# EAGLE design veils_v110 (EAGLE 5.09)

## Sheet 1 of 5
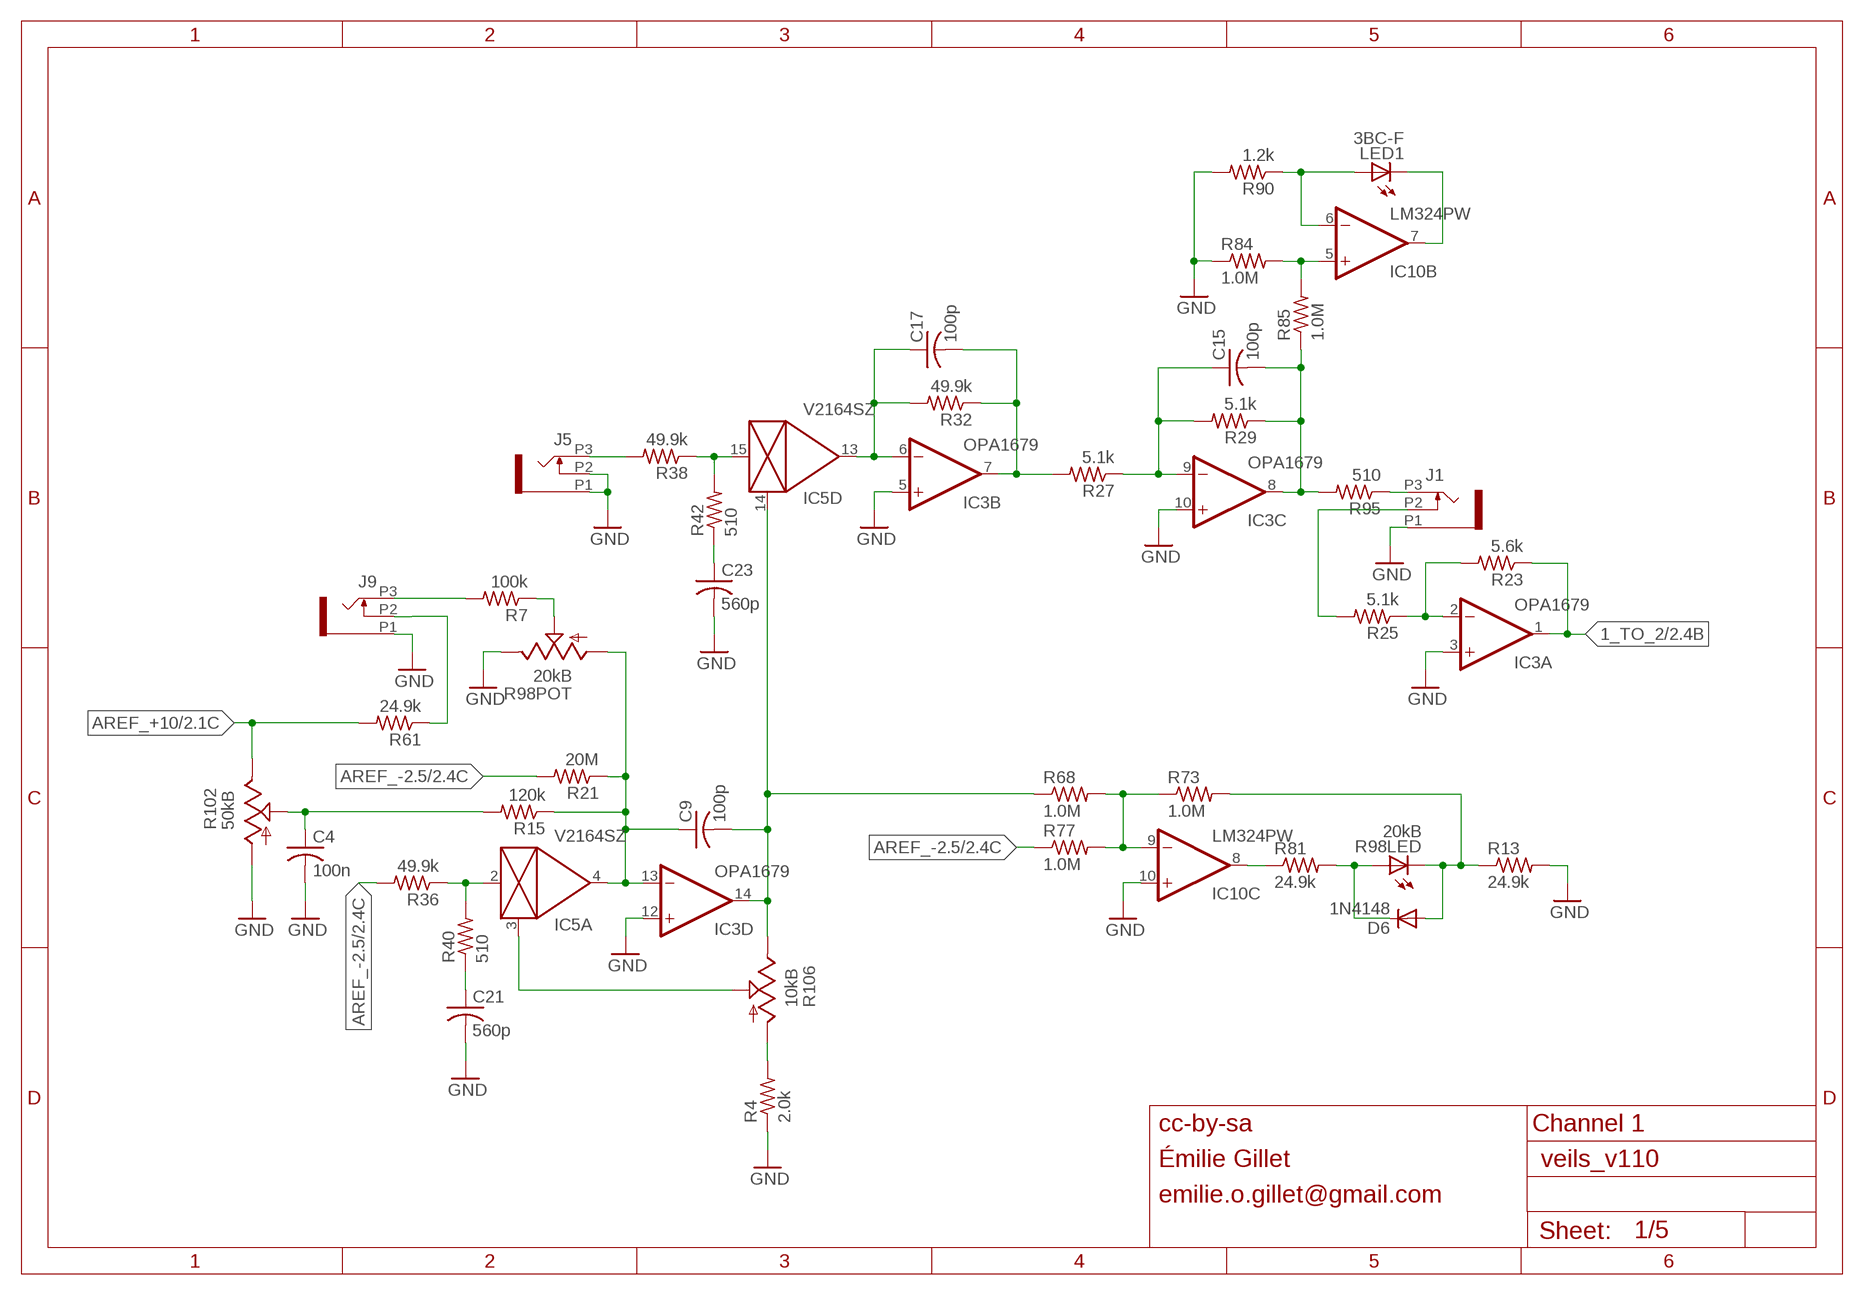
[diagram p0: schematic, sheet 1]

### Parts
C4  100n  C-USC0402  [C0402]
C9  100p  C-USC0402  [C0402]
C15  100p  C-USC0402  [C0402]
C17  100p  C-USC0402  [C0402]
C21  560p  C-USC0402  [C0402]
C23  560p  C-USC0402  [C0402]
D6  1N4148  DIODE-SOD523  [SOD523]
IC3  OPA1679  OPA1679PW  [TSSOP14_065]
IC5  V2164SZ  SSM2164S  [SOIC16N]
IC10  LM324PW  TL074PW  [TSSOP14_065]
J1  PJ301_THONKICONNTME  [WQP_PJ_301M_TME]
J5  PJ301_THONKICONNTME  [WQP_PJ_301M_TME]
J9  PJ301_THONKICONNTME  [WQP_PJ_301M_TME]
LED1  3BC-F  LED3MM  [LED3MM]
R4  2.0k  R-US_R0402  [R0402]
R7  100k  R-US_R0402  [R0402]
R13  24.9k  R-US_R0402  [R0402]
R15  120k  R-US_R0402  [R0402]
R21  20M  R-US_R0402  [R0402]
R23  5.6k  R-US_R0402  [R0402]
R25  5.1k  R-US_R0402  [R0402]
R27  5.1k  R-US_R0402  [R0402]
R29  5.1k  R-US_R0402  [R0402]
R32  49.9k  R-US_R0402  [R0402]
R36  49.9k  R-US_R0402  [R0402]
R38  49.9k  R-US_R0402  [R0402]
R40  510  R-US_R0402  [R0402]
R42  510  R-US_R0402  [R0402]
R61  24.9k  R-US_R0402  [R0402]
R68  1.0M  R-US_R0402  [R0402]
R73  1.0M  R-US_R0402  [R0402]
R77  1.0M  R-US_R0402  [R0402]
R81  24.9k  R-US_R0402  [R0402]
R84  1.0M  R-US_R0402  [R0402]
R85  1.0M  R-US_R0402  [R0402]
R90  1.2k  R-US_R0402  [R0402]
R95  510  R-US_R0603  [R0603]
R98  20kB  BOURNS_SLIDER  [BOURNS_SLIDER]
R102  50kB  POT_USVERTICAL_NARROW  [ALPS_POT_NARROW]
R106  10kB  POT_USVERTICAL_NARROW  [ALPS_POT_NARROW]

### Nets
1_TO_2: IC3.1(A:OUT) R23.1 ; also sheet 2
AREF_+10: R61.2 R102.P$1(E) ; also sheet 2,3,4,5
AREF_-2.5: R21.2 R36.2 R77.1 ; also sheet 2,3,4,5
CV_IN_1: J9.P3 R7.2
FOO: IC5.2(A:IN) R36.1 R40.2
GND: C4.2 C21.2 C23.2 IC3.3(A:+IN) IC3.5(B:+IN) IC3.10(C:+IN) IC3.12(D:+IN) IC10.10(C:+IN) J1.P1 J5.P1 J5.P2 J9.P1 R4.1 R13.2 R84.1 R90.2 R98.3(POT:E) R102.P$3(A) ; also sheet 2,3,4,5
N$1: IC10.5(B:+IN) R84.2 R85.2
N$7: J1.P3 R95.1
N$9: IC5.3(A:CTRL) R106.P$2(S)
N$10: C15.1 IC3.9(C:-IN) R27.1 R29.2
N$14: C4.1 R15.2 R102.P$2(S)
N$15: R4.2 R106.P$3(A)
N$18: IC10.7(B:OUT) LED1.K(C)
N$19: IC10.6(B:-IN) LED1.A R90.1
N$20: C21.1 R40.1
N$22: IC3.2(A:-IN) R23.2 R25.1
N$25: J1.P2 R25.2
N$30: J9.P2 R61.1
N$31: R7.1 R98.2(POT:S)
N$47: C23.1 R42.1
N$50: IC10.8(C:OUT) R81.1
N$54: D6.A R13.1 R73.2 R98.E(LED:C)
N$57: IC10.9(C:-IN) R68.2 R73.1 R77.2
N$65: C9.1 IC3.13(D:-IN) IC5.4(A:OUT) R15.1 R21.1 R98.1(POT:A)
N$66: J5.P3 R38.2
N$75: IC5.15(D:IN) R38.1 R42.2
N$77: C9.2 IC3.14(D:OUT) IC5.14(D:CTRL) R68.1 R106.P$1(E)
N$96: C17.1 IC3.6(B:-IN) IC5.13(D:OUT) R32.2
N$100: C17.2 IC3.7(B:OUT) R27.2 R32.1
OUT1: C15.2 IC3.8(C:OUT) R29.1 R85.1 R95.2
PROT1: D6.C R81.2 R98.B(LED:A)

### Notes on the sheet
- cc-by-sa | Channel 1
- Émilie Gillet
- emilie.o.gillet@gmail.com

## Sheet 2 of 5
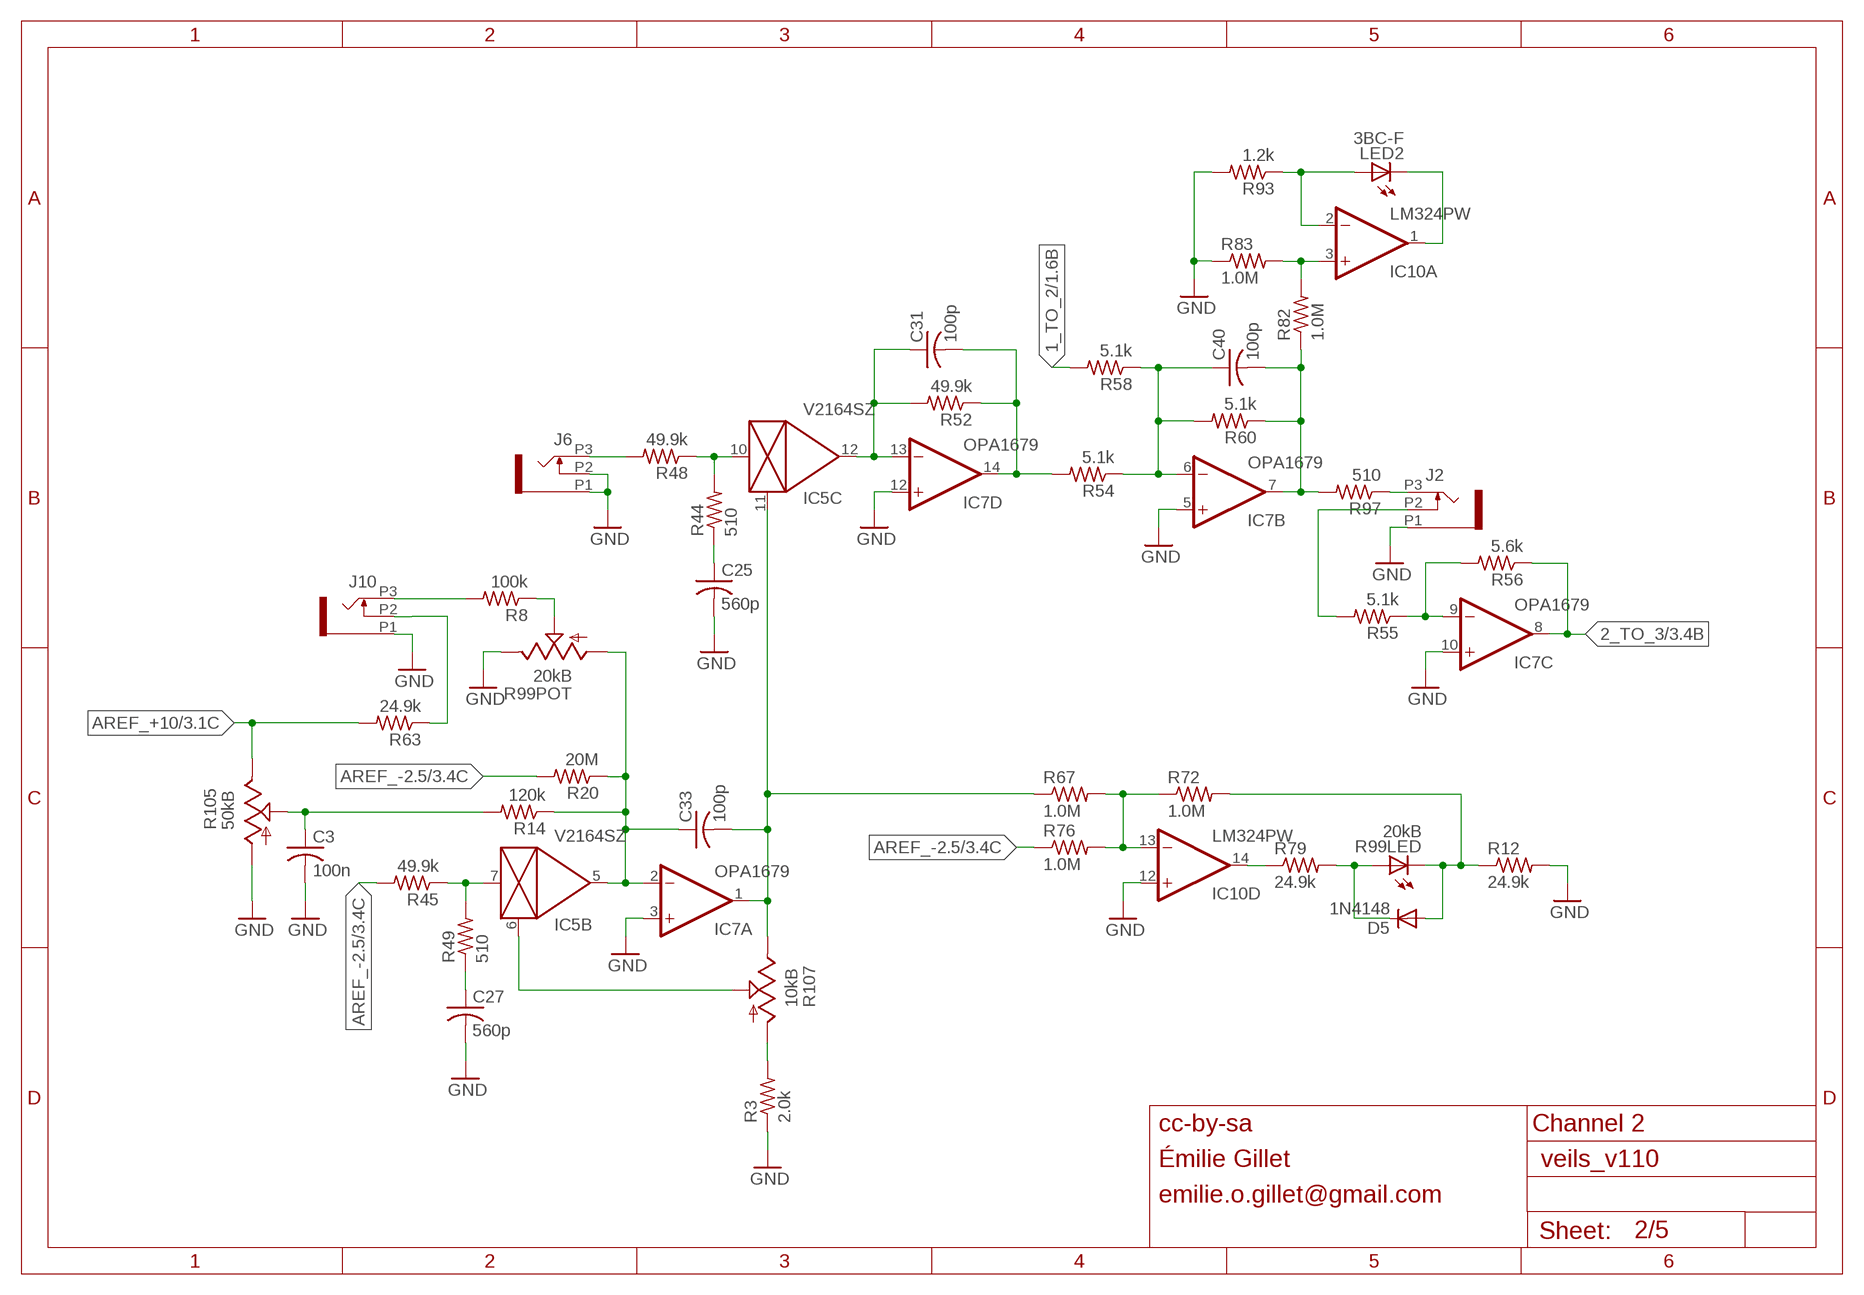
[diagram p1: schematic, sheet 2]

### Parts
C3  100n  C-USC0402  [C0402]
C25  560p  C-USC0402  [C0402]
C27  560p  C-USC0402  [C0402]
C31  100p  C-USC0402  [C0402]
C33  100p  C-USC0402  [C0402]
C40  100p  C-USC0402  [C0402]
D5  1N4148  DIODE-SOD523  [SOD523]
IC7  OPA1679  OPA1679PW  [TSSOP14_065]
J2  PJ301_THONKICONNTME  [WQP_PJ_301M_TME]
J6  PJ301_THONKICONNTME  [WQP_PJ_301M_TME]
J10  PJ301_THONKICONNTME  [WQP_PJ_301M_TME]
LED2  3BC-F  LED3MM  [LED3MM]
R3  2.0k  R-US_R0402  [R0402]
R8  100k  R-US_R0402  [R0402]
R12  24.9k  R-US_R0402  [R0402]
R14  120k  R-US_R0402  [R0402]
R20  20M  R-US_R0402  [R0402]
R44  510  R-US_R0402  [R0402]
R45  49.9k  R-US_R0402  [R0402]
R48  49.9k  R-US_R0402  [R0402]
R49  510  R-US_R0402  [R0402]
R52  49.9k  R-US_R0402  [R0402]
R54  5.1k  R-US_R0402  [R0402]
R55  5.1k  R-US_R0402  [R0402]
R56  5.6k  R-US_R0402  [R0402]
R58  5.1k  R-US_R0402  [R0402]
R60  5.1k  R-US_R0402  [R0402]
R63  24.9k  R-US_R0402  [R0402]
R67  1.0M  R-US_R0402  [R0402]
R72  1.0M  R-US_R0402  [R0402]
R76  1.0M  R-US_R0402  [R0402]
R79  24.9k  R-US_R0402  [R0402]
R82  1.0M  R-US_R0402  [R0402]
R83  1.0M  R-US_R0402  [R0402]
R93  1.2k  R-US_R0402  [R0402]
R97  510  R-US_R0603  [R0603]
R99  20kB  BOURNS_SLIDER  [BOURNS_SLIDER]
R105  50kB  POT_USVERTICAL_NARROW  [ALPS_POT_NARROW]
R107  10kB  POT_USVERTICAL_NARROW  [ALPS_POT_NARROW]

### Nets
1_TO_2: R58.2 ; also sheet 1
2_TO_3: IC7.8(C:OUT) R56.1 ; also sheet 3
AREF_+10: R63.2 R105.P$1(E) ; also sheet 1,3,4,5
AREF_-2.5: R20.2 R45.2 R76.1 ; also sheet 1,3,4,5
FOO1: IC5.7(B:IN) R45.1 R49.2
GND: C3.2 C25.2 C27.2 IC7.3(A:+IN) IC7.5(B:+IN) IC7.10(C:+IN) IC7.12(D:+IN) IC10.12(D:+IN) J2.P1 J6.P1 J6.P2 J10.P1 R3.1 R12.2 R83.1 R93.2 R99.3(POT:E) R105.P$3(A) ; also sheet 1,3,4,5
N$3: J6.P3 R48.2
N$4: IC10.3(A:+IN) R82.2 R83.2
N$6: J2.P3 R97.1
N$17: C25.1 R44.1
N$21: J10.P2 R63.1
N$24: IC5.10(C:IN) R44.2 R48.1
N$26: IC5.6(B:CTRL) R107.P$2(S)
N$27: C40.1 IC7.6(B:-IN) R54.1 R58.1 R60.2
N$32: R3.2 R107.P$3(A)
N$33: R8.1 R99.2(POT:S)
N$35: IC10.1(A:OUT) LED2.K(C)
N$36: IC10.2(A:-IN) LED2.A R93.1
N$37: IC7.9(C:-IN) R55.1 R56.2
N$38: J2.P2 R55.2
N$39: C31.2 IC7.14(D:OUT) R52.1 R54.2
N$40: J10.P3 R8.2
N$41: C27.1 R49.1
N$42: C33.1 IC5.5(B:OUT) IC7.2(A:-IN) R14.1 R20.1 R99.1(POT:A)
N$53: C31.1 IC5.12(C:OUT) IC7.13(D:-IN) R52.2
N$68: D5.A R12.1 R72.2 R99.E(LED:C)
N$74: IC10.14(D:OUT) R79.1
N$78: IC10.13(D:-IN) R67.2 R72.1 R76.2
N$80: C33.2 IC5.11(C:CTRL) IC7.1(A:OUT) R67.1 R107.P$1(E)
N$101: C3.1 R14.2 R105.P$2(S)
OUT2: C40.2 IC7.7(B:OUT) R60.1 R82.1 R97.2
PROT2: D5.C R79.2 R99.B(LED:A)

### Notes on the sheet
- cc-by-sa | Channel 2
- Émilie Gillet
- emilie.o.gillet@gmail.com

## Sheet 3 of 5
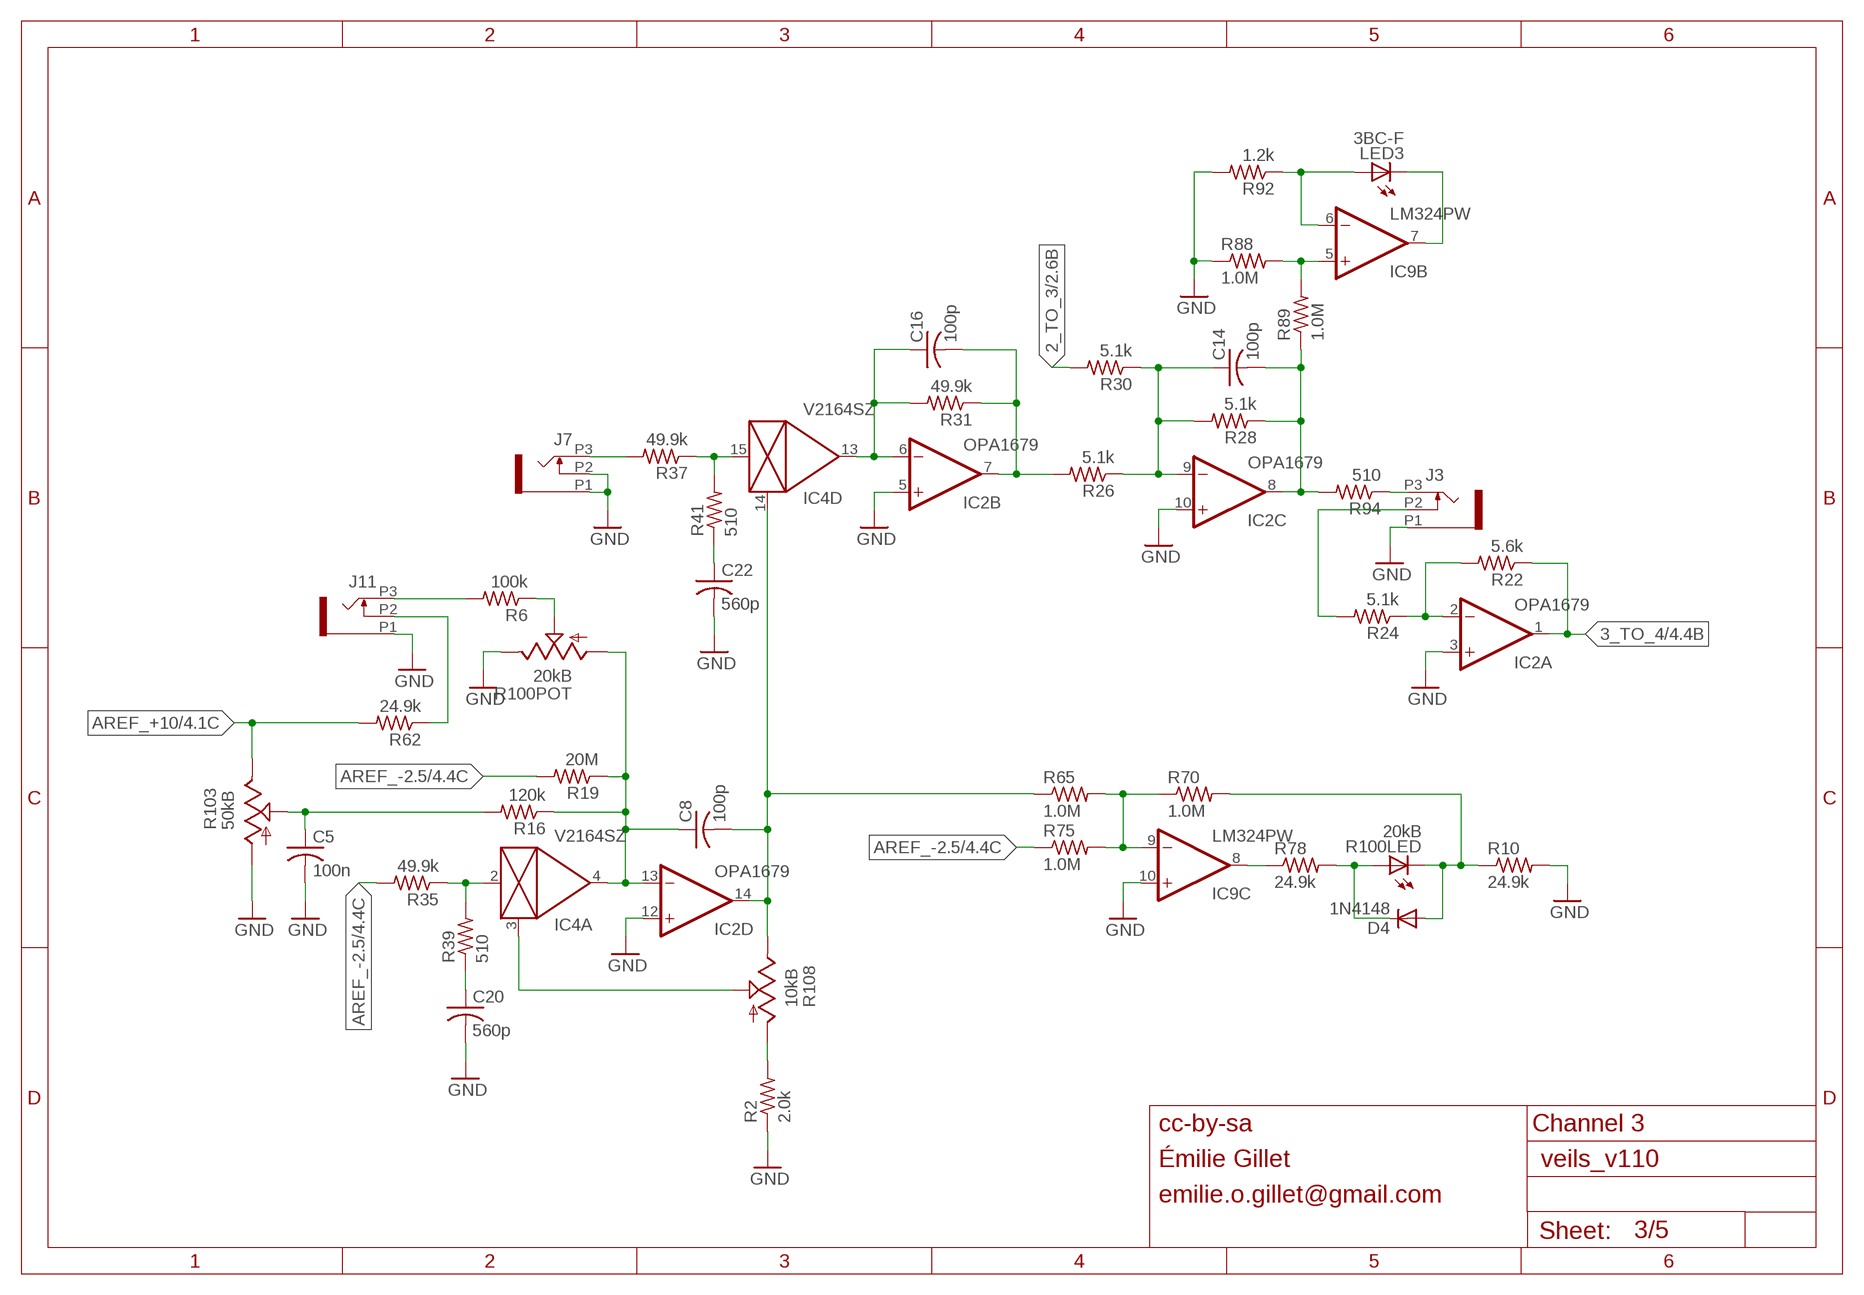
[diagram p2: schematic, sheet 3]

### Parts
C5  100n  C-USC0402  [C0402]
C8  100p  C-USC0402  [C0402]
C14  100p  C-USC0402  [C0402]
C16  100p  C-USC0402  [C0402]
C20  560p  C-USC0402  [C0402]
C22  560p  C-USC0402  [C0402]
D4  1N4148  DIODE-SOD523  [SOD523]
IC2  OPA1679  OPA1679PW  [TSSOP14_065]
IC4  V2164SZ  SSM2164S  [SOIC16N]
IC9  LM324PW  TL074PW  [TSSOP14_065]
J3  PJ301_THONKICONNTME  [WQP_PJ_301M_TME]
J7  PJ301_THONKICONNTME  [WQP_PJ_301M_TME]
J11  PJ301_THONKICONNTME  [WQP_PJ_301M_TME]
LED3  3BC-F  LED3MM  [LED3MM]
R2  2.0k  R-US_R0402  [R0402]
R6  100k  R-US_R0402  [R0402]
R10  24.9k  R-US_R0402  [R0402]
R16  120k  R-US_R0402  [R0402]
R19  20M  R-US_R0402  [R0402]
R22  5.6k  R-US_R0402  [R0402]
R24  5.1k  R-US_R0402  [R0402]
R26  5.1k  R-US_R0402  [R0402]
R28  5.1k  R-US_R0402  [R0402]
R30  5.1k  R-US_R0402  [R0402]
R31  49.9k  R-US_R0402  [R0402]
R35  49.9k  R-US_R0402  [R0402]
R37  49.9k  R-US_R0402  [R0402]
R39  510  R-US_R0402  [R0402]
R41  510  R-US_R0402  [R0402]
R62  24.9k  R-US_R0402  [R0402]
R65  1.0M  R-US_R0402  [R0402]
R70  1.0M  R-US_R0402  [R0402]
R75  1.0M  R-US_R0402  [R0402]
R78  24.9k  R-US_R0402  [R0402]
R88  1.0M  R-US_R0402  [R0402]
R89  1.0M  R-US_R0402  [R0402]
R92  1.2k  R-US_R0402  [R0402]
R94  510  R-US_R0603  [R0603]
R100  20kB  BOURNS_SLIDER  [BOURNS_SLIDER]
R103  50kB  POT_USVERTICAL_NARROW  [ALPS_POT_NARROW]
R108  10kB  POT_USVERTICAL_NARROW  [ALPS_POT_NARROW]

### Nets
2_TO_3: R30.2 ; also sheet 2
3_TO_4: IC2.1(A:OUT) R22.1 ; also sheet 4
AREF_+10: R62.2 R103.P$1(E) ; also sheet 1,2,4,5
AREF_-2.5: R19.2 R35.2 R75.1 ; also sheet 1,2,4,5
FOO2: IC4.2(A:IN) R35.1 R39.2
GND: C5.2 C20.2 C22.2 IC2.3(A:+IN) IC2.5(B:+IN) IC2.10(C:+IN) IC2.12(D:+IN) IC9.10(C:+IN) J3.P1 J7.P1 J7.P2 J11.P1 R2.1 R10.2 R88.1 R92.2 R100.3(POT:E) R103.P$3(A) ; also sheet 1,2,4,5
N$5: IC9.5(B:+IN) R88.2 R89.2
N$23: J3.P3 R94.1
N$29: IC4.3(A:CTRL) R108.P$2(S)
N$34: R2.2 R108.P$3(A)
N$44: J11.P3 R6.2
N$45: C22.1 R41.1
N$46: IC4.15(D:IN) R37.1 R41.2
N$49: C14.1 IC2.9(C:-IN) R26.1 R28.2 R30.1
N$52: J7.P3 R37.2
N$56: C16.1 IC2.6(B:-IN) IC4.13(D:OUT) R31.2
N$58: IC9.7(B:OUT) LED3.K(C)
N$59: IC9.6(B:-IN) LED3.A R92.1
N$60: IC2.2(A:-IN) R22.2 R24.1
N$61: J3.P2 R24.2
N$63: C20.1 R39.1
N$64: R6.1 R100.2(POT:S)
N$67: C8.1 IC2.13(D:-IN) IC4.4(A:OUT) R16.1 R19.1 R100.1(POT:A)
N$79: IC9.8(C:OUT) R78.1
N$82: D4.A R10.1 R70.2 R100.E(LED:C)
N$83: IC9.9(C:-IN) R65.2 R70.1 R75.2
N$87: C8.2 IC2.14(D:OUT) IC4.14(D:CTRL) R65.1 R108.P$1(E)
N$89: J11.P2 R62.1
N$102: C5.1 R16.2 R103.P$2(S)
N$103: C16.2 IC2.7(B:OUT) R26.2 R31.1
OUT3: C14.2 IC2.8(C:OUT) R28.1 R89.1 R94.2
PROT3: D4.C R78.2 R100.B(LED:A)

### Notes on the sheet
- cc-by-sa | Channel 3
- Émilie Gillet
- emilie.o.gillet@gmail.com

## Sheet 4 of 5
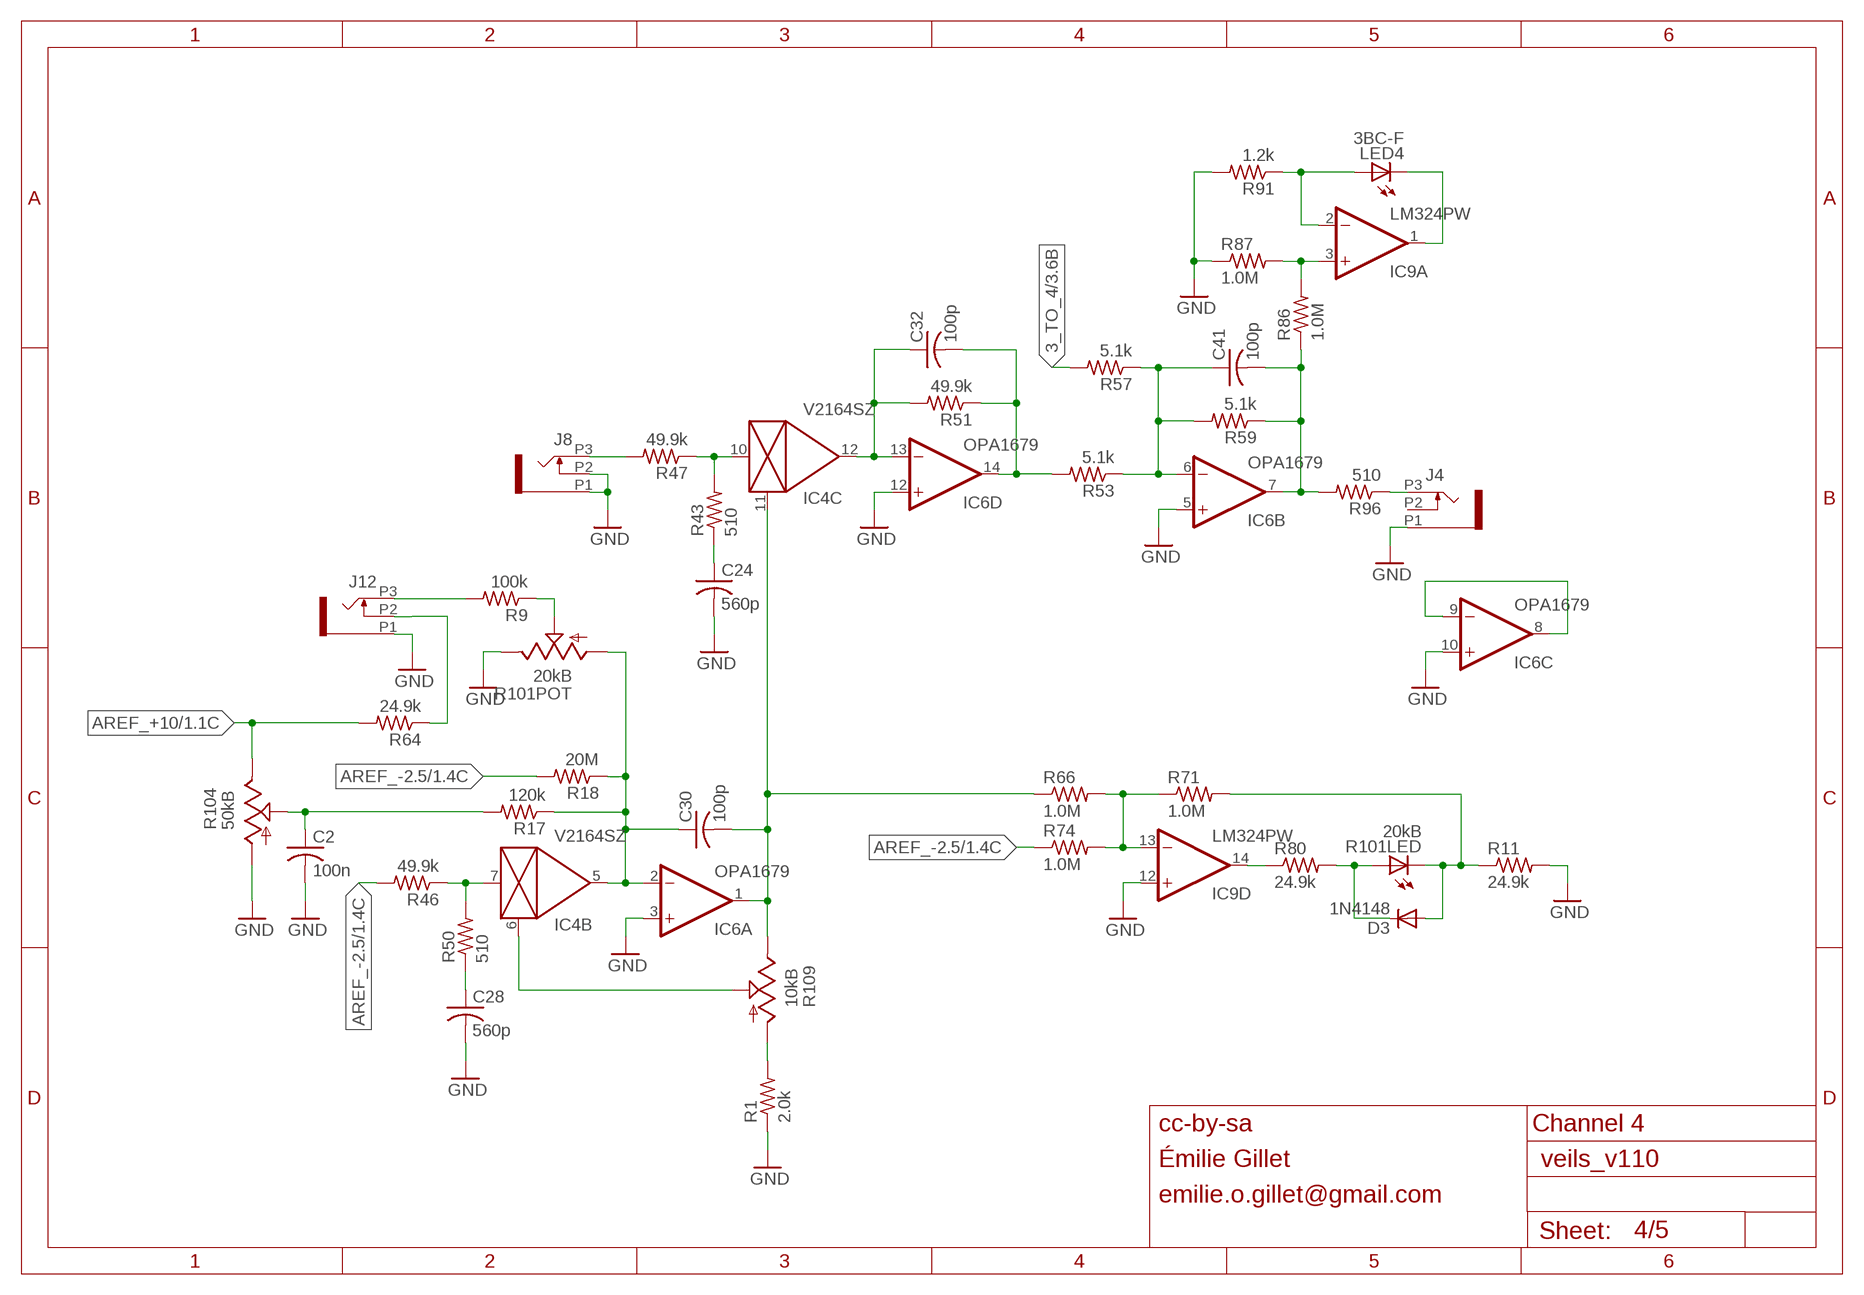
[diagram p3: schematic, sheet 4]

### Parts
C2  100n  C-USC0402  [C0402]
C24  560p  C-USC0402  [C0402]
C28  560p  C-USC0402  [C0402]
C30  100p  C-USC0402  [C0402]
C32  100p  C-USC0402  [C0402]
C41  100p  C-USC0402  [C0402]
D3  1N4148  DIODE-SOD523  [SOD523]
IC6  OPA1679  OPA1679PW  [TSSOP14_065]
J4  PJ301_THONKICONNTME  [WQP_PJ_301M_TME]
J8  PJ301_THONKICONNTME  [WQP_PJ_301M_TME]
J12  PJ301_THONKICONNTME  [WQP_PJ_301M_TME]
LED4  3BC-F  LED3MM  [LED3MM]
R1  2.0k  R-US_R0402  [R0402]
R9  100k  R-US_R0402  [R0402]
R11  24.9k  R-US_R0402  [R0402]
R17  120k  R-US_R0402  [R0402]
R18  20M  R-US_R0402  [R0402]
R43  510  R-US_R0402  [R0402]
R46  49.9k  R-US_R0402  [R0402]
R47  49.9k  R-US_R0402  [R0402]
R50  510  R-US_R0402  [R0402]
R51  49.9k  R-US_R0402  [R0402]
R53  5.1k  R-US_R0402  [R0402]
R57  5.1k  R-US_R0402  [R0402]
R59  5.1k  R-US_R0402  [R0402]
R64  24.9k  R-US_R0402  [R0402]
R66  1.0M  R-US_R0402  [R0402]
R71  1.0M  R-US_R0402  [R0402]
R74  1.0M  R-US_R0402  [R0402]
R80  24.9k  R-US_R0402  [R0402]
R86  1.0M  R-US_R0402  [R0402]
R87  1.0M  R-US_R0402  [R0402]
R91  1.2k  R-US_R0402  [R0402]
R96  510  R-US_R0603  [R0603]
R101  20kB  BOURNS_SLIDER  [BOURNS_SLIDER]
R104  50kB  POT_USVERTICAL_NARROW  [ALPS_POT_NARROW]
R109  10kB  POT_USVERTICAL_NARROW  [ALPS_POT_NARROW]

### Nets
3_TO_4: R57.2 ; also sheet 3
AREF_+10: R64.2 R104.P$1(E) ; also sheet 1,2,3,5
AREF_-2.5: R18.2 R46.2 R74.1 ; also sheet 1,2,3,5
FOO3: IC4.7(B:IN) R46.1 R50.2
GND: C2.2 C24.2 C28.2 IC6.3(A:+IN) IC6.5(B:+IN) IC6.10(C:+IN) IC6.12(D:+IN) IC9.12(D:+IN) J4.P1 J8.P1 J8.P2 J12.P1 R1.1 R11.2 R87.1 R91.2 R101.3(POT:E) R104.P$3(A) ; also sheet 1,2,3,5
N$2: IC6.8(C:OUT) IC6.9(C:-IN)
N$8: IC9.3(A:+IN) R86.2 R87.2
N$43: IC4.6(B:CTRL) R109.P$2(S)
N$48: J12.P2 R64.1
N$51: R1.2 R109.P$3(A)
N$55: J12.P3 R9.2
N$62: C32.1 IC4.12(C:OUT) IC6.13(D:-IN) R51.2
N$69: J8.P3 R47.2
N$70: R9.1 R101.2(POT:S)
N$71: J4.P3 R96.1
N$72: C24.1 R43.1
N$73: IC4.10(C:IN) R43.2 R47.1
N$76: C41.1 IC6.6(B:-IN) R53.1 R57.1 R59.2
N$84: IC9.1(A:OUT) LED4.K(C)
N$85: IC9.2(A:-IN) LED4.A R91.1
N$86: IC9.14(D:OUT) R80.1
N$88: C32.2 IC6.14(D:OUT) R51.1 R53.2
N$90: C28.1 R50.1
N$91: C30.1 IC4.5(B:OUT) IC6.2(A:-IN) R17.1 R18.1 R101.1(POT:A)
N$92: D3.A R11.1 R71.2 R101.E(LED:C)
N$93: IC9.13(D:-IN) R66.2 R71.1 R74.2
N$95: C30.2 IC4.11(C:CTRL) IC6.1(A:OUT) R66.1 R109.P$1(E)
N$104: C2.1 R17.2 R104.P$2(S)
OUT4: C41.2 IC6.7(B:OUT) R59.1 R86.1 R96.2
PROT4: D3.C R80.2 R101.B(LED:A)
Unconnected: J4.P2

### Notes on the sheet
- cc-by-sa | Channel 4
- Émilie Gillet
- emilie.o.gillet@gmail.com

## Sheet 5 of 5
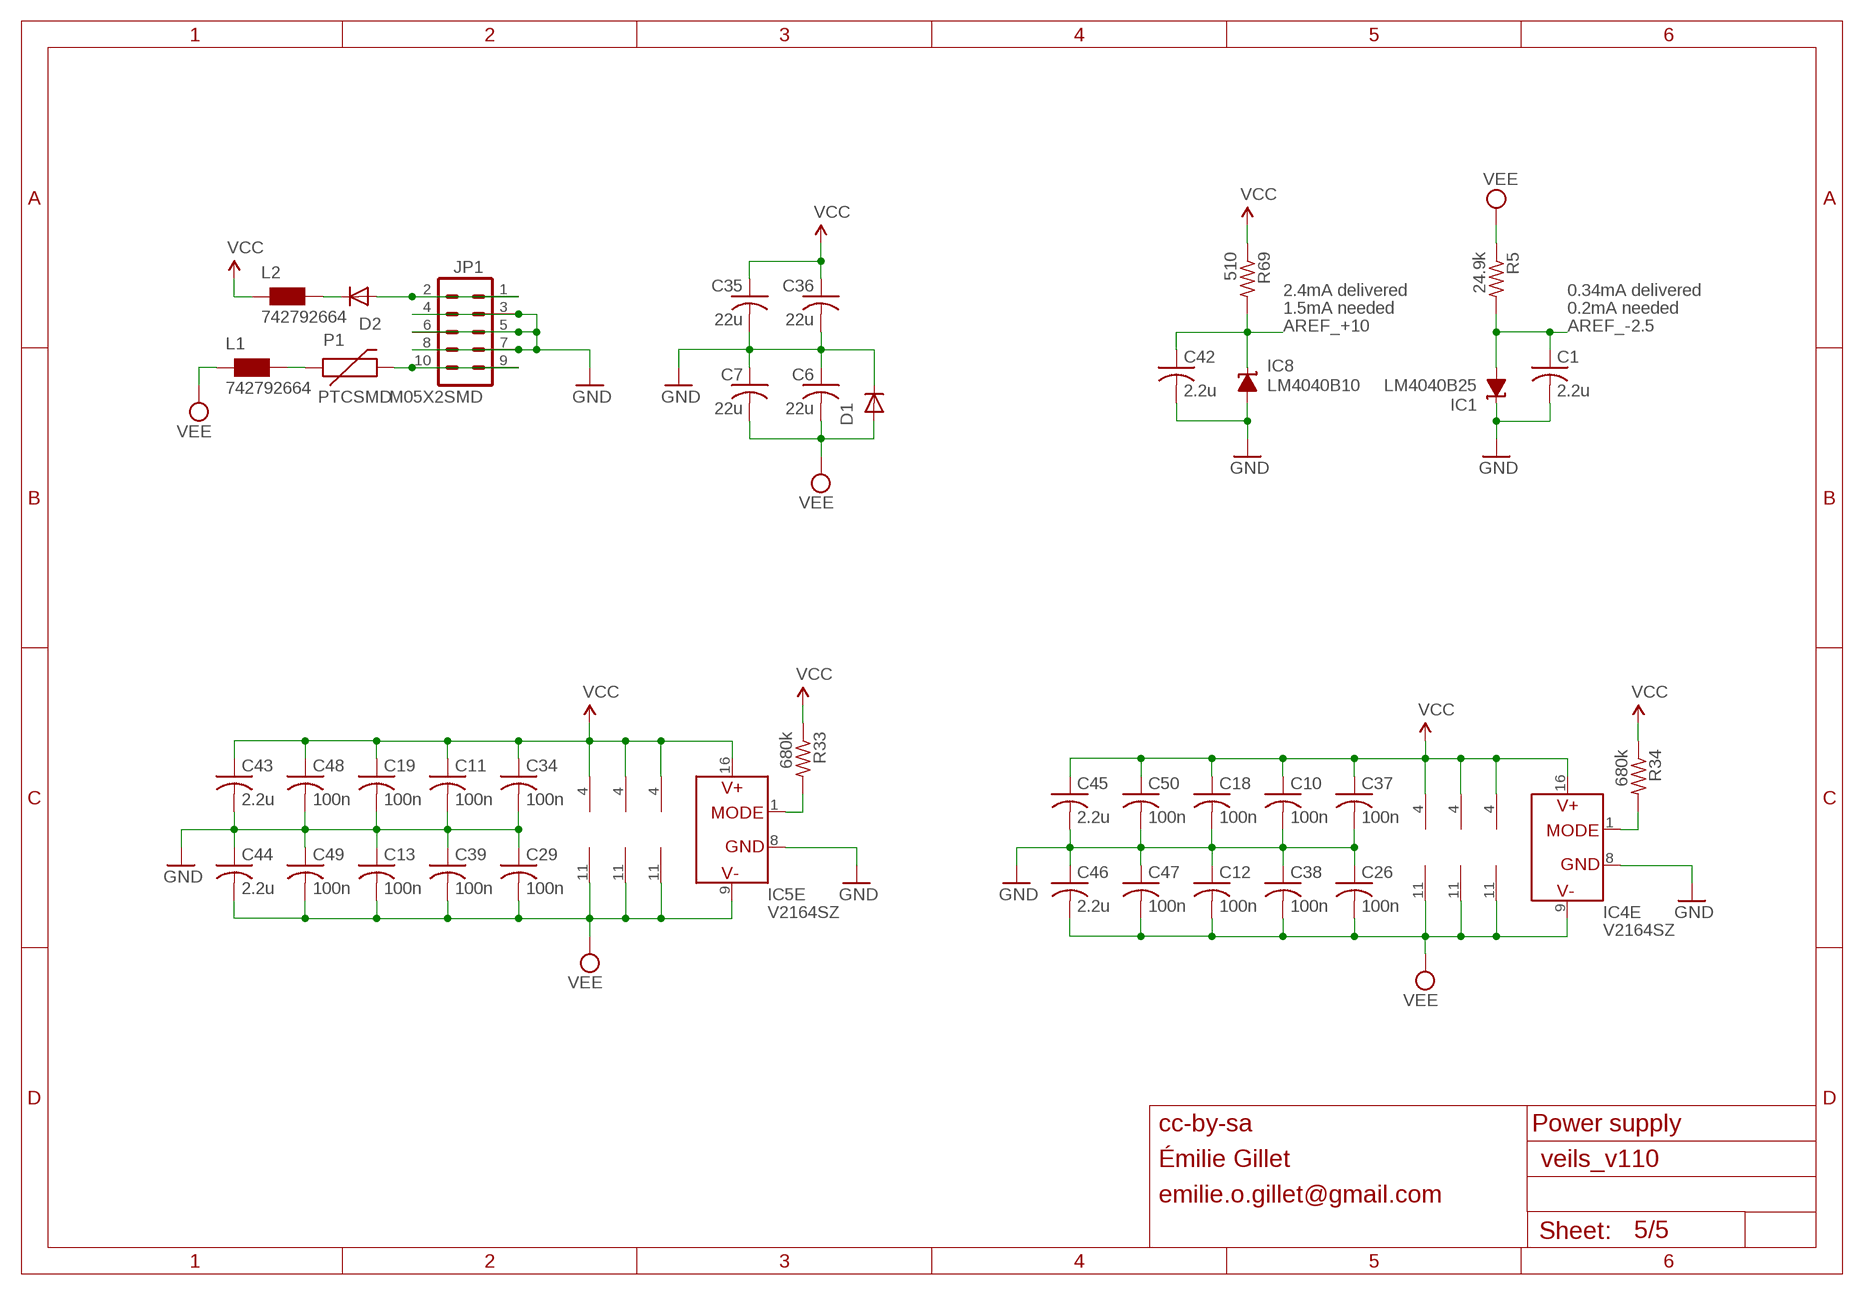
[diagram p4: schematic, sheet 5]

### Parts
C1  2.2u  C-USC0603  [C0603]
C6  22u  C-USC1206  [C1206]
C7  22u  C-USC1206  [C1206]
C10  100n  C-USC0402  [C0402]
C11  100n  C-USC0402  [C0402]
C12  100n  C-USC0402  [C0402]
C13  100n  C-USC0402  [C0402]
C18  100n  C-USC0402  [C0402]
C19  100n  C-USC0402  [C0402]
C26  100n  C-USC0402  [C0402]
C29  100n  C-USC0402  [C0402]
C34  100n  C-USC0402  [C0402]
C35  22u  C-USC1206  [C1206]
C36  22u  C-USC1206  [C1206]
C37  100n  C-USC0402  [C0402]
C38  100n  C-USC0402  [C0402]
C39  100n  C-USC0402  [C0402]
C42  2.2u  C-USC0603  [C0603]
C43  2.2u  C-USC0603  [C0603]
C44  2.2u  C-USC0603  [C0603]
C45  2.2u  C-USC0603  [C0603]
C46  2.2u  C-USC0603  [C0603]
C47  100n  C-USC0402  [C0402]
C48  100n  C-USC0402  [C0402]
C49  100n  C-USC0402  [C0402]
C50  100n  C-USC0402  [C0402]
D1  1N5819HW  DIODE-SOD123  [SOD123]
D2  1N5819HW  DIODE-SOD123  [SOD123]
IC1  LM4040B25  LM4041B12DBZ  [DBZ_R-PDSO-G3]
IC8  LM4040B10  LM4041B12DBZ  [DBZ_R-PDSO-G3]
JP1  M05X2SMD  [2X5-SMD]
L1  742792664  WE-CBF_0603  [0603]
L2  742792664  WE-CBF_0603  [0603]
P1  PTCSMD  [PTC-1206]
R5  24.9k  R-US_R0402  [R0402]
R33  680k  R-US_R0402  [R0402]
R34  680k  R-US_R0402  [R0402]
R69  510  R-US_R0402  [R0402]

### Nets
AREF_+10: C42.1 IC8.1(C) R69.2 ; also sheet 1,2,3,4
AREF_-2.5: C1.1 IC1.2(A) R5.2 ; also sheet 1,2,3,4
GND: C1.2 C6.1 C7.1 C10.2 C11.2 C12.1 C13.1 C18.2 C19.2 C26.1 C29.1 C34.2 C35.2 C36.2 C37.2 C38.1 C39.1 C42.2 C43.2 C44.1 C45.2 C46.1 C47.1 C48.2 C49.1 C50.2 D1.C IC1.1(C) IC4.8(E:GND) IC5.8(E:GND) IC8.2(A) JP1.3 JP1.4 JP1.5 JP1.6 JP1.7 JP1.8 ; also sheet 1,2,3,4
N$11: D2.A JP1.1 JP1.2
N$12: JP1.9 JP1.10 P1.2
N$13: L1.2 P1.1
N$16: D2.C L2.2
N$28: IC5.1(E:MODE) R33.2
N$81: IC4.1(E:MODE) R34.2
VCC: C10.1 C11.1 C18.1 C19.1 C34.1 C35.1 C36.1 C37.1 C43.1 C45.1 C48.1 C50.1 IC2.4(P:V+) IC3.4(P:V+) IC4.16(E:V+) IC5.16(E:V+) IC6.4(P:V+) IC7.4(P:V+) IC9.4(P:V+) IC10.4(P:V+) L2.1 R33.1 R34.1 R69.1
VEE: C6.2 C7.2 C12.2 C13.2 C26.2 C29.2 C38.2 C39.2 C44.2 C46.2 C47.2 C49.2 D1.A IC2.11(P:V-) IC3.11(P:V-) IC4.9(E:V-) IC5.9(E:V-) IC6.11(P:V-) IC7.11(P:V-) IC9.11(P:V-) IC10.11(P:V-) L1.1 R5.1

### Notes on the sheet
- 2.4mA delivered | 0.34mA delivered
- 1.5mA needed | 0.2mA needed
- cc-by-sa | Power supply
- Émilie Gillet
- emilie.o.gillet@gmail.com

## Library data of the parts
C1-C50 = rcl:C-US: CAPACITOR, American symbol
D1-D6 = diode:DIODE-: DIODE
IC1 IC8 = texas:LM4041: PRECISION MICROPOWER SHUNT VOLTAGE REFERENCE Source: http://focus.ti.com/lit/ds/slcs146e/slcs146e.pdf
IC2 IC3 IC6 IC7 = og-linear:OPA1679
IC4 IC5 = ssm2164:SSM2164
IC9 IC10 = og-linear:TL074: OP AMP
J1-J12 = og-pj301:PJ301_THONKICONN
JP1 = og-header:M05X2: Header 5x2 Standard 10-pin dual row 0.1" header. Commonly used with AVR-ISP. Use with Spark Fun Electronics SKU: PRT-00778
L1 L2 = wuerth-elektronik:WE-CBF: SMD EMI Suppression Ferrite Beads - excellent anti-EMI properties - low DCR - impedances till 3000 ohms - rated current up to 6 A
LED1-LED4 = led:LED: LED OSRAM: - CHIPLED LG R971, LG N971, LY N971, LG Q971, LY Q971, LO R971, LY R971 LH N974, LH R974 LS Q976, LO Q976, LY Q976 LO Q996 - Hyper CHIPLED LW Q18S LB Q993, LB Q99A, LB R99A - SideLED LS A670, LO A670, LY A670, LG A670, LP A670 LB A673, LV A673, LT A673, LW A673 LH A674 LY A675 LS A676, LA A676, LO A676, LY A676, LW A676 LS A679, LY A679, LG A679 - Hyper Micro SIDELED® LS Y876, LA Y876, LO Y876, LY Y876 LT Y87S - SmartLED LW L88C, LW L88S LB L89C, LB L89S, LG L890 LS L89K, LO L89K, LY L89K LS L896, LA L896, LO L896, LY L896 - TOPLED LS T670, LO T670, LY T670, LG T670, LP T670 LSG T670, LSP T670, LSY T670, LOP T670, LYG T670 LG T671, LOG T671, LSG T671 LB T673, LV T673, LT T673, LW T673 LH T674 LS T676, LA T676, LO T676, LY T676, LB T676, LH T676, LSB T676, LW T676 LB T67C, LV T67C, LT T67C, LS T67K, LO T67K, LY T67K, LW E67C LS E67B, LA E67B, LO E67B, LY E67B, LB E67C, LV E67C, LT E67C LW T67C LS T679, LY T679, LG T679 LS T770, LO T770, LY T770, LG T770, LP T770 LB T773, LV T773, LT T773, LW T773 LH T774 LS E675, LA E675, LY E675, LS T675 LS T776, LA T776, LO T776, LY T776, LB T776 LHGB T686 LT T68C, LB T68C - Hyper Mini TOPLED® LB M676 - Mini TOPLED Santana® LG M470 LS M47K, LO M47K, LY M47K Source: http://www.osram.convergy.de LUXEON: - LUMILED® LXK2-PW12-R00, LXK2-PW12-S00, LXK2-PW14-U00, LXK2-PW14-V00 LXK2-PM12-R00, LXK2-PM12-S00, LXK2-PM14-U00 LXK2-PE12-Q00, LXK2-PE12-R00, LXK2-PE12-S00, LXK2-PE14-T00, LXK2-PE14-U00 LXK2-PB12-K00, LXK2-PB12-L00, LXK2-PB12-M00, LXK2-PB14-N00, LXK2-PB14-P00, LXK2-PB14-Q00 LXK2-PR12-L00, LXK2-PR12-M00, LXK2-PR14-Q00, LXK2-PR14-R00 LXK2-PD12-Q00, LXK2-PD12-R00, LXK2-PD12-S00 LXK2-PH12-R00, LXK2-PH12-S00 LXK2-PL12-P00, LXK2-PL12-Q00, LXK2-PL12-R00 Source: www.luxeon.com KINGBRIGHT: KA-3528ASYC Source: www.kingbright.com
P1 = SparkFun:PTC: Resettable Fuse PTC Resettable Fuse. Spark Fun Electronics SKU : COM-08357
R1-R97 = rcl:R-US_: RESISTOR, American symbol
R98-R101 = og-pots:BOURNS_SLIDER
R102-R109 = og-pots:POT_US

## Board
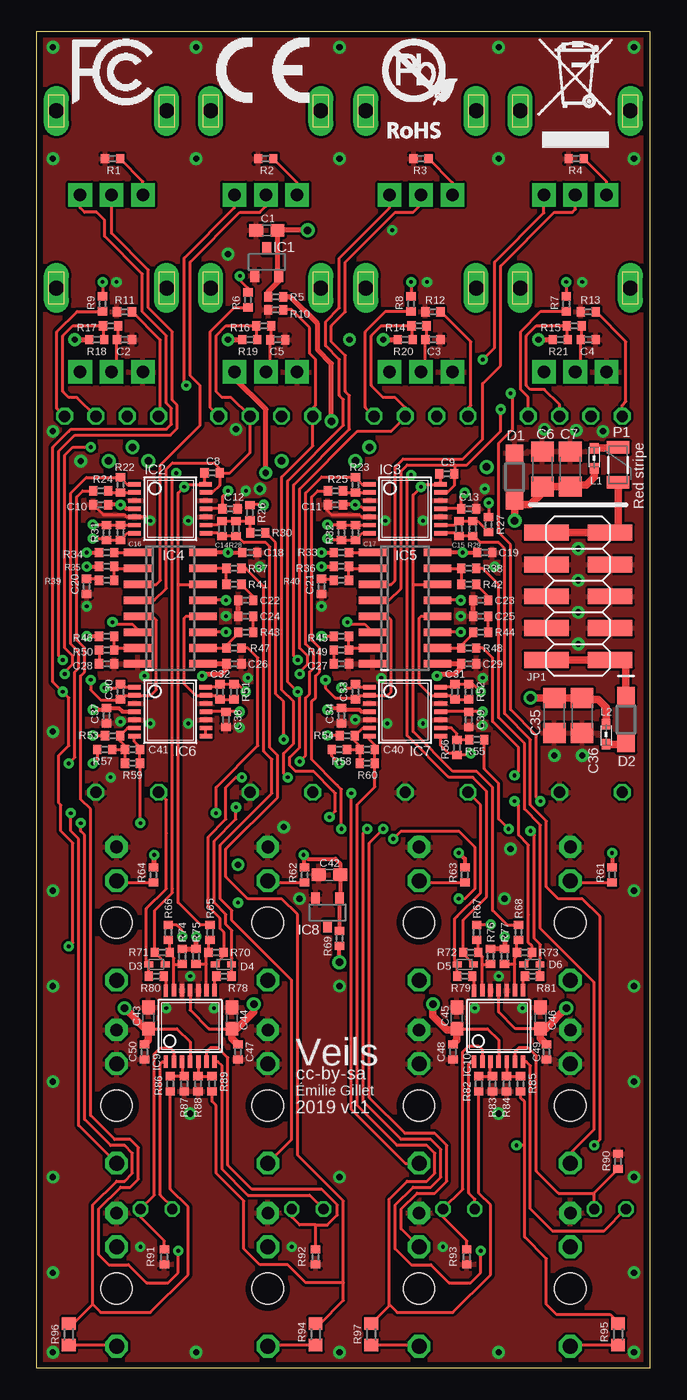
[diagram p5: board, top side]
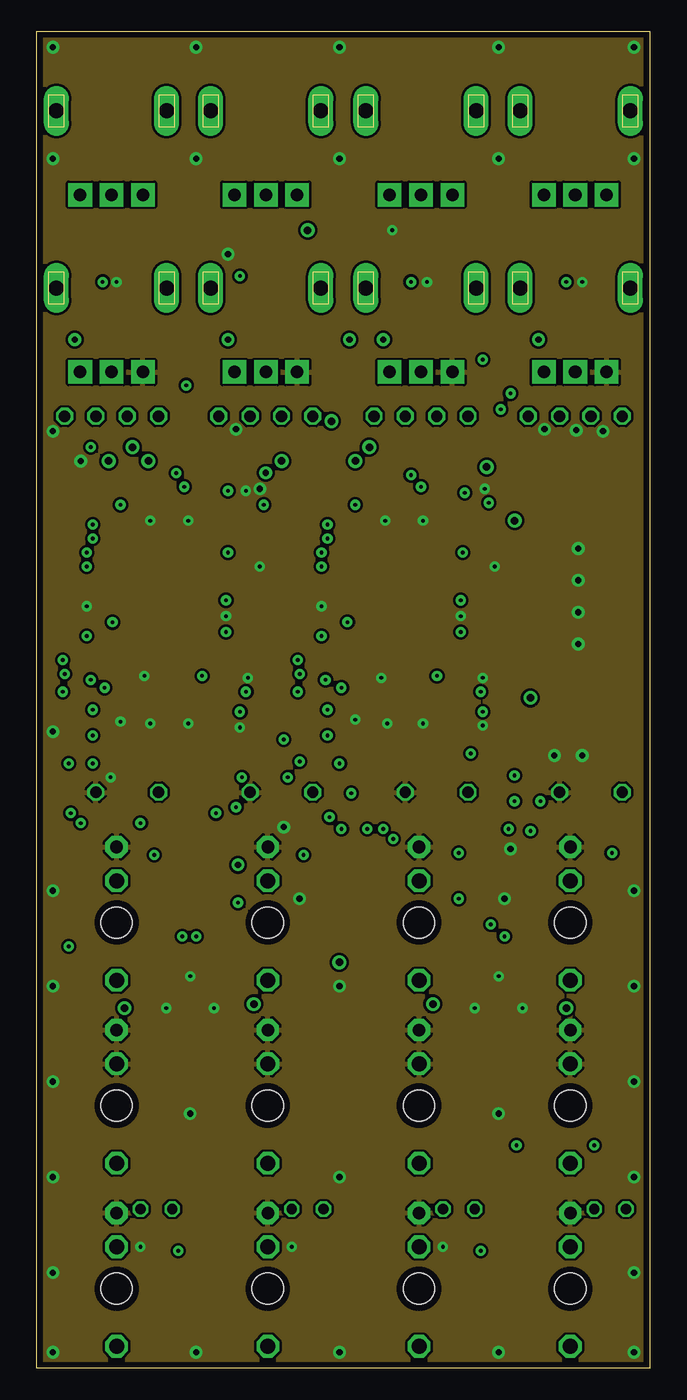
[diagram p6: board, inner layer InternalGround]
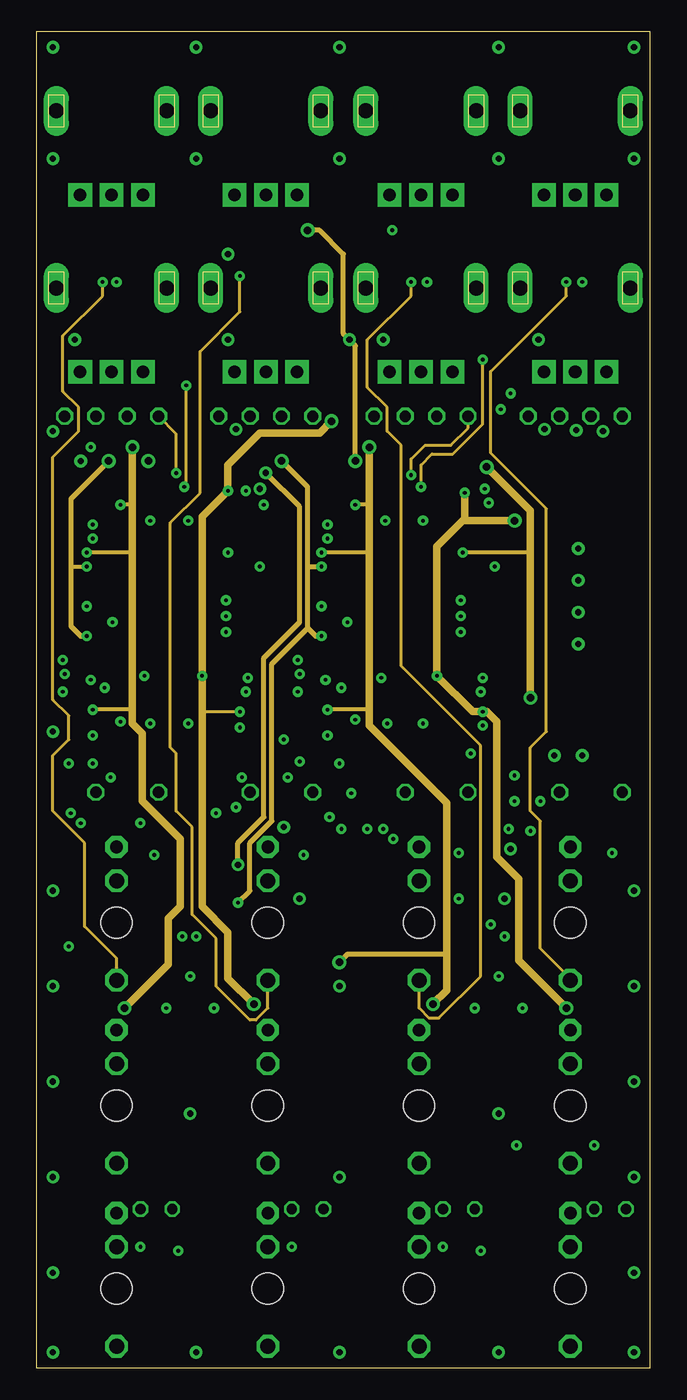
[diagram p7: board, inner layer Supplies]
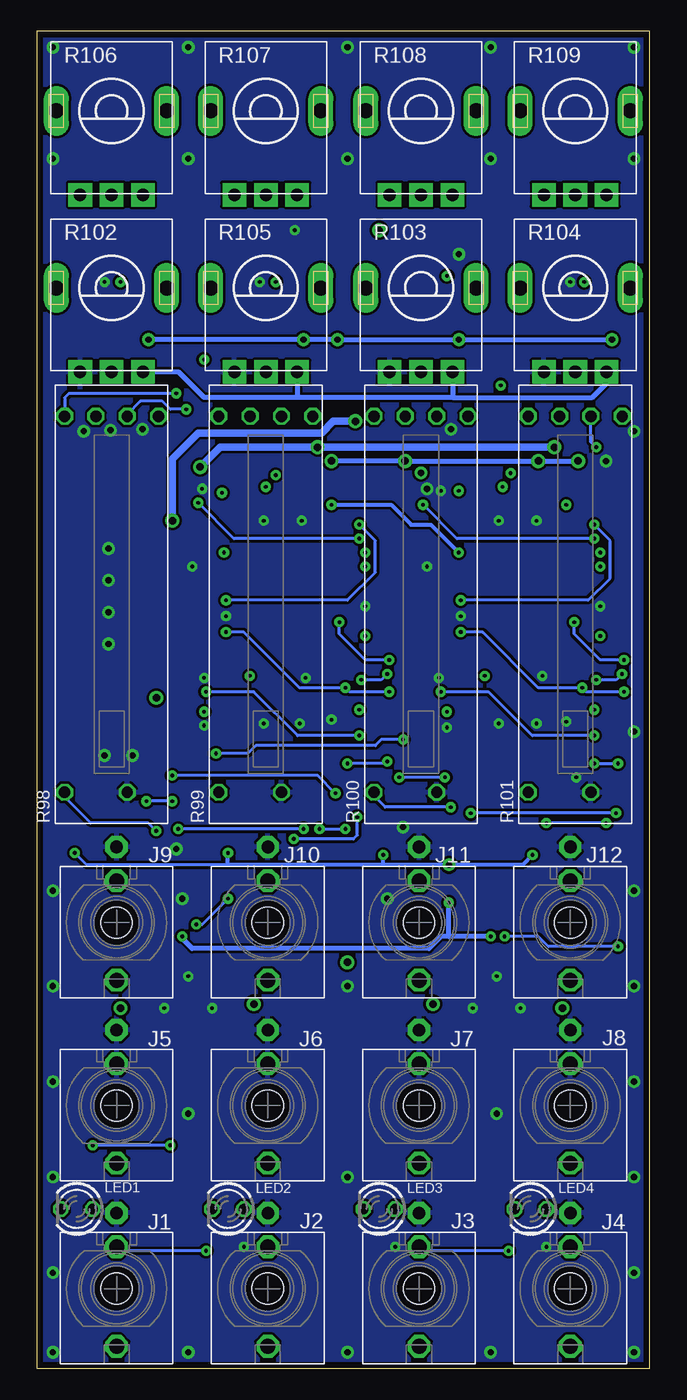
[diagram p8: board, bottom side, seen from below]

Size 48.9 x 106.68 mm. Coordinates in mm from the lower left corner, seen from the top.
Outline: 48.9,0 0,0 0,106.68 48.9,106.68 48.9,0
Copper layers (1+2*15+16): Top 0.05mm / dielectric 0.3mm / InternalGround 0.05mm / dielectric 0.75mm / Supplies 0.035mm / dielectric 0.2mm / Bottom 0.05mm
Design rules "PCBCart-Standard-4L *": minimum track width 8mil, minimum drill 0.3mm, track to track 8mil, track to pad 8mil, pad to pad 8mil, via to via 8mil, smd to smd 8mil, copper to edge 20mil, drill to drill 8mil, minimum pad ring 8mil, minimum via ring 10mil, stop-mask expansion 3mil, vias tented up to drill 25mil, thermal gap 8mil

### Footprints (pad centres in the part's own frame; a part is rotated, then mirrored left to right if it is on the bottom)
C0603 = smd 1.1 x 1: 1 -0.85,0; 2 0.85,0
C0402 = smd 0.65 x 0.75: 1 -0.6,0; 2 0.6,0
C1206 = smd 1.6 x 1.8: 1 -1.4,0; 2 1.4,0
SOD123 = smd 1.4 x 1.4: A 1.9,0; C -1.9,0
SOD523 = smd 0.7 x 0.5: A 0.7,0; C -0.6,0
DBZ_R-PDSO-G3 = smd 0.7 x 1: 1 -0.95,-1.1; 2 0.95,-1.1; 3 0,1.1
TSSOP14_065 = smd 0.35 x 1: 1 -1.95,-2.845; 2 -1.3,-2.845; 3 -0.65,-2.845; 4 0,-2.845; 5 0.65,-2.845; 6 1.3,-2.845; 7 1.95,-2.845; 8 1.95,2.845; 9 1.3,2.845; 10 0.65,2.845; 11 0,2.845; 12 -0.65,2.845; 13 -1.3,2.845; 14 -1.95,2.825
SOIC16N = smd 0.6 x 2.2: 1 -4.445,-2.6; 2 -3.175,-2.6; 3 -1.905,-2.6; 4 -0.635,-2.6; 5 0.635,-2.6; 6 1.905,-2.6; 7 3.175,-2.6; 8 4.445,-2.6; 9 4.445,2.6; 10 3.175,2.6; 11 1.905,2.6; 12 0.635,2.6; 13 -0.635,2.6; 14 -1.905,2.6; 15 -3.175,2.6; 16 -4.445,2.6
WQP_PJ_301M_TME = drill 1 pad 1.778 octagon: P1 0,-6.032 | drill 1.2 pad 1.778 octagon: P2 0,-3.334; P3 0,4.604 | hole 2.5: 0,0
2X5-SMD = smd 3.556 x 1.27: 1 -2.54,5.08; 2 2.54,5.08; 3 -2.54,2.54; 4 2.54,2.54; 5 -2.54,0; 6 2.54,0; 7 -2.54,-2.54; 8 2.54,-2.54; 9 -2.54,-5.08; 10 2.54,-5.08
0603 = smd 0.85 x 0.7: 1 -0.9,0; 2 0.7,0
LED3MM = drill 0.813 octagon: A -1.27,0; K 1.27,0
PTC-1206 = smd 1 x 1.8: 1 -1.4,0; 2 1.4,0
R0402 = smd 0.65 x 0.75: 1 -0.6,0; 2 0.6,0
R0603 = smd 1 x 1.1: 1 -0.85,0; 2 0.85,0
BOURNS_SLIDER = drill 0.9 octagon: 1 -15,1.25; 2 -15,3.75; 3 15,1.25; B 15,-3.75; DUMMY -15,-1.25; E -15,-3.75
ALPS_POT_NARROW = drill 1 pad 1.88 square: P$1 -2.5,6.7; P$2 0,6.7; P$3 2.5,6.7 | drill 1.2 pad 2 long: P$4 -4.4,0; P$5 4.4,0

### Placement (x,y rotation side)
C1  18.34,90.81 180 top
C2  6.99,82.07 0 top
C3  31.59,82.07 0 top
C4  43.97,82.07 0 top
C5  19.21,82.07 0 top
C6  40.32,71.76 270 top
C7  42.54,71.76 270 top
C8  13.97,71.44 180 top
C9  32.7,71.36 180 top
C10  5.08,68.9 180 top
C11  23.81,68.9 180 top
C12  15.4,68.58 180 top
C13  34.45,68.58 180 top
C14  14.76,66.99 270 top
C15  33.65,66.99 270 top
C16  6.67,66.68 270 top
C17  25.4,66.68 270 top
C18  16.99,65.09 0 top
C19  35.72,65.09 0 top
C20  3.97,62.39 270 top
C21  22.7,62.39 270 top
C22  16.67,61.28 180 top
C23  35.4,61.28 180 top
C24  16.67,60.01 180 top
C25  35.4,60.01 180 top
C26  15.72,56.2 180 top
C27  24.29,56.2 0 top
C28  5.56,56.2 0 top
C29  34.45,56.2 180 top
C30  6.67,53.98 90 top
C31  33.34,53.98 90 top
C32  14.61,53.98 90 top
C33  25.4,53.98 90 top
C34  24.29,52.07 270 top
C35  41.27,52.07 270 top
C36  43.5,52.07 270 top
C37  5.56,52.07 270 top
C38  15.08,51.75 90 top
C39  34.45,51.75 90 top
C40  26.35,49.37 0 top
C41  7.62,49.37 0 top
C42  23.34,39.37 180 top
C43  8.89,27.94 90 top
C44  15.56,27.94 270 top
C45  33.5,27.94 90 top
C46  40.16,27.94 270 top
C47  16.03,25.24 90 top
C48  33.18,25.24 270 top
C49  40.64,25.24 90 top
C50  8.57,25.24 270 top
D1  38.1,71.12 270 top
D2  46.99,51.75 90 top
D3  9.53,32.23 0 top
D4  14.92,32.23 180 top
D5  34.13,32.23 0 top
D6  39.53,32.23 180 top
IC1  18.34,88.27 0 top
IC2  10.64,68.58 270 top
IC3  29.37,68.58 270 top
IC4  10.64,60.64 270 top
IC5  29.37,60.64 270 top
IC6  10.64,52.39 270 top
IC7  29.37,52.39 270 top
IC8  23.18,36.35 180 top
IC9  12.22,27.3 0 top
IC10  36.83,27.3 0 top
J1  42.55,6.35 180 bottom
J2  30.48,6.35 180 bottom
J3  18.41,6.35 180 bottom
J4  6.35,6.35 180 bottom
J5  42.55,20.95 180 bottom
J6  30.48,20.95 180 bottom
J7  18.41,20.95 180 bottom
J8  6.35,20.95 180 bottom
J9  42.55,35.56 180 bottom
J10  30.48,35.56 180 bottom
J11  18.41,35.56 180 bottom
J12  6.35,35.56 180 bottom
JP1  43.18,61.6 180 top
L1  44.45,72.71 90 top
L2  45.4,50.48 270 top
LED1  45.72,12.7 180 bottom
LED2  33.66,12.7 180 bottom
LED3  21.59,12.7 180 bottom
LED4  9.53,12.7 180 bottom
P1  46.35,72.07 270 top
R1  6.03,96.52 0 top
R2  18.26,96.52 0 top
R3  30.64,96.52 0 top
R4  43.02,96.52 0 top
R5  19.05,85.49 180 top
R6  16.83,85.25 90 top
R7  42.23,84.93 90 top
R8  29.84,84.93 90 top
R9  5.24,84.93 90 top
R10  19.05,84.46 180 top
R11  6.99,84.3 180 top
R12  31.59,84.3 180 top
R13  43.97,84.3 180 top
R14  30.48,83.19 0 top
R15  42.86,83.19 0 top
R16  18.1,83.19 0 top
R17  5.87,83.18 0 top
R18  4.76,82.07 180 top
R19  16.99,82.07 180 top
R20  29.37,82.07 180 top
R21  41.75,82.07 180 top
R22  6.67,70.49 270 top
R23  25.4,70.49 270 top
R24  5.08,70.01 180 top
R25  23.81,70.01 180 top
R26  16.99,68.26 90 top
R27  36.04,67.31 90 top
R28  15.88,66.99 90 top
R29  34.77,66.99 90 top
R30  17.62,66.68 0 top
R31  5.56,66.68 90 top
R32  24.29,66.67 90 top
R33  24.29,65.09 0 top
R34  5.56,65.09 0 top
R35  5.56,63.98 180 top
R36  24.29,63.98 180 top
R37  15.72,63.82 0 top
R38  34.45,63.82 0 top
R39  5.56,62.87 0 top
R40  24.29,62.87 0 top
R41  15.72,62.55 180 top
R42  34.45,62.55 180 top
R43  16.67,58.74 180 top
R44  35.4,58.74 180 top
R45  24.29,58.42 180 top
R46  5.56,58.42 180 top
R47  15.72,57.47 0 top
R48  34.45,57.47 0 top
R49  24.29,57.31 0 top
R50  5.56,57.31 0 top
R51  15.72,53.98 270 top
R52  34.45,53.98 270 top
R53  6.03,50.48 180 top
R54  24.77,50.48 180 top
R55  35.08,50.16 0 top
R56  33.5,49.53 90 top
R57  5.4,49.37 180 top
R58  24.13,49.37 180 top
R59  7.62,48.26 180 top
R60  26.35,48.26 180 top
R61  45.88,39.37 90 top
R62  21.35,39.37 90 top
R63  34.13,39.37 90 top
R64  9.29,39.37 90 top
R65  13.81,34.77 270 top
R66  10.48,34.77 270 top
R67  35.08,34.77 270 top
R68  38.42,34.77 270 top
R69  24.13,34.29 90 top
R70  14.29,33.18 0 top
R71  10,33.18 180 top
R72  34.61,33.18 180 top
R73  38.89,33.18 0 top
R74  11.59,32.86 270 top
R75  12.7,32.86 270 top
R76  36.19,32.86 270 top
R77  37.31,32.86 270 top
R78  14.92,31.27 0 top
R79  34.13,31.27 180 top
R80  9.53,31.27 180 top
R81  39.53,31.27 0 top
R82  35.24,22.7 90 top
R83  36.35,22.7 90 top
R84  37.47,22.7 90 top
R85  38.58,22.7 90 top
R86  10.64,22.7 90 top
R87  11.75,22.7 90 top
R88  12.86,22.7 90 top
R89  13.97,22.7 90 top
R90  46.36,16.51 90 top
R91  10.16,8.89 270 top
R92  22.23,8.89 270 top
R93  34.29,8.89 270 top
R94  22.23,2.7 90 top
R95  46.35,2.7 90 top
R96  2.54,2.7 90 top
R97  26.67,2.7 90 top
R98  42.94,60.96 270 bottom
R99  30.64,60.96 270 bottom
R100  18.26,60.96 270 bottom
R101  5.95,60.96 270 bottom
R102  42.94,86.2 180 bottom
R103  18.26,86.2 180 bottom
R104  5.95,86.2 180 bottom
R105  30.64,86.2 180 bottom
R106  42.94,100.33 180 bottom
R107  30.64,100.33 180 bottom
R108  18.26,100.33 180 bottom
R109  5.95,100.33 180 bottom
U$1  [CE_MEDIUM]  14.29,100.96 0 top
U$2  [FCC_MEDIUM]  2.86,100.81 0 top
U$3  [ROHS_LOGO]  27.94,98.11 0 top
U$4  [TRASHCAN_LOGO]  40.16,97.16 0 top

### Tracks (layer width: path | path; a pad name or v marks a point on that pad's centre or on a via)
1_TO_2  (via drill 0.3)
  Top 0.254: v20.95,48.42 21.43,48.9 21.43,53.5 21.75,53.82 21.75,55.56 22.07,55.88 22.07,57.15 21.43,57.78 21.43,69.85 22.7,71.12 25.36,71.12 R23.1 25.95,70.53 IC3.1 | v24.13,48.26 23.53,48.86 R58.2
  Bottom 0.254: v20.95,48.42 21.11,48.26 v24.13,48.26
2_TO_3  (via drill 0.3)
  Top 0.254: R30.2 18.26,66.67 19.05,65.88 19.05,53.82 19.68,53.18 v19.68,50.16 | v34.61,49.05 34.48,48.93 R56.1 33.37,49.05 32.86,49.05 32.23,49.69 32.23,50.42 IC7.8
  Bottom 0.254: v19.68,50.16 21.43,50.16 21.91,49.69 31.43,49.69 32.07,49.05 v34.61,49.05
3_TO_4  (via drill 0.3)
  Top 0.254: v2.54,48.26 3.02,48.74 3.02,55.56 3.33,55.88 3.33,57.15 2.7,57.78 2.7,69.85 3.93,71.08 R22.1 7.22,70.53 IC2.1 | v4.45,48.26 4.8,48.61 R57.2
  Bottom 0.254: v4.45,48.26 v2.54,48.26
AREF_+10  (via drill 0.3, 0.5)
  Top 0.305: R62.2 21.27,40.05 v21.27,40.96 21.59,40.64 23.81,40.64 24.19,40.27 C42.1 24.19,37.58 24.09,37.49 IC8.1 R69.2 | R63.2 | R63.2 34.13,40.64 v33.66,41.12 | v45.88,41.12 R61.2
  Top 0.406: R64.2 9.37,40.05 v9.37,40.96 | v18.26,71.44 18.26,76.53 15.76,79.03 R103.P$1
  Supplies 0.406: v18.26,71.44 20.95,68.74 20.95,59.53 18.1,56.67 18.1,43.97 16.03,41.91 v16.03,40.16
  Bottom 0.254: v45.88,41.12 44.93,40.16 33.34,40.16
  Bottom 0.305: v9.37,40.96 10.16,40.16 v16.03,40.16 21.27,40.16 | 21.27,40.16 33.34,40.16 33.66,40.16 v33.66,41.12 | 21.27,40.16 v21.27,40.96
  Bottom 0.406: R104.P$1 3.49,79.46 3.49,78.58 4.6,77.47 15.72,77.47 | 28.1,77.47 35.56,77.47 37.59,79.5 R102.P$1 | R105.P$1 28.1,79.46 28.1,77.47 | 15.72,77.47 28.1,77.47 | R103.P$1 15.72,79.46 15.72,77.47
AREF_-2.5  (via drill 0.3, 0.5, 0.6)
  Top 0.254: R45.2 | v22.7,58.42 R45.2
  Top 0.305: R35.2 | v3.97,63.98 R35.2 | v22.7,63.98 R36.2 | v3.97,58.42 R46.2
  Top 0.406: v12.7,34.45 R75.1 R74.1 | R77.1 | R77.1 R76.1 | v37.31,34.45 | v37.31,34.45 R77.1 | v3.02,82.07 R18.2 | v15.24,82.07 R19.2 | v27.62,82.07 R20.2 | v40.01,82.07 R21.2 | v21.59,90.81 | v21.59,90.81 C1.1 19.19,87.27 IC1.2 19.29,86.75 18.41,85.88 18.41,85.52 R5.2
  Supplies 0.305: 2.7,63.98 v3.97,63.98
  Supplies 0.406: 2.7,65.88 2.7,69.37 4.92,71.6 v5.71,72.39 | v19.53,72.39 | v21.59,90.81 22.54,90.81 24.45,88.9 24.45,82.55 v24.92,82.07 25.4,81.6 v25.4,72.39 | 2.7,65.88 | 2.7,65.88 2.7,63.98 2.7,59.21 3.49,58.42 v3.97,58.42 | v19.53,72.39 21.59,70.33 21.59,63.98 | 21.59,59.05 21.59,63.98 | 21.59,59.05 18.73,56.2 18.73,43.66 16.99,41.91 16.99,38.1 v16.03,37.15 | 21.59,59.05 22.23,58.42 v22.7,58.42 | 21.59,63.98 v22.7,63.98
  Bottom 0.406: v5.71,72.39 | v5.71,72.39 | v19.53,72.39 | v19.53,72.39 v25.4,72.39 | v8.89,72.39 v5.71,72.39 | v8.89,72.39 | v19.53,72.39 v8.89,72.39 | v12.7,34.45 16.03,34.45 | 16.03,34.45 16.67,34.45 17.62,33.5 36.51,33.5 37.31,34.29 v37.31,34.45 | 16.03,34.45 v16.03,37.15 | v3.02,82.07 v15.24,82.07 v24.92,82.07 v27.62,82.07 v40.01,82.07
CV_IN_1  (via drill 0.3)
  Top 0.254: R7.2 v42.23,86.68
  Supplies 0.254: J9.P3 42.55,31.11 40.16,33.5 40.16,43.66 39.37,44.45 39.37,49.53 40.64,50.8 40.64,68.58 36.2,73.03 36.2,79.53 42.23,85.57 v42.23,86.68
FOO
  Top 0.254: R40.2 R36.1 25.05,63.82 IC5.2
FOO1
  Top 0.254: R49.2 25.05,57.47 IC5.7 | R49.2 | R49.2 R45.1
FOO2
  Top 0.254: R39.2 R35.1 6.32,63.82 IC4.2
FOO3
  Top 0.254: R50.2 | R50.2 R46.1 | R50.2 6.32,57.47 IC4.7
GND  (via drill 0.3, 0.5)
  Top 0.254: 23.18,68.86 C11.2 23.18,68.86 | C10.2 5.27,68.1 6.99,68.1 7.14,67.94 8.73,67.94 v9.05,67.63 | 23.18,68.86 23.18,68.42 23.5,68.1 25.72,68.1 25.89,67.93 IC3.5
  Top 0.406: C22.2 | C24.2 C22.2 | C23.2 | C25.2 C23.2
  other vias: 28.34,90.81 8.25,9.68 16.19,51.12 6.67,51.59 16.83,55.09 15.08,60.01 17.78,63.98 9.05,51.44 12.06,51.44 12.06,67.63 16.67,70.01 8.57,55.25 1.27,105.41 32.38,9.68 5.87,47.15 27.46,55.09 33.81,60.01 36.51,63.98 25.4,51.75 27.78,67.63 30.8,67.63 27.94,51.44 30.8,51.44 35.56,55.09 35.56,51.28 35.72,70.17 43.18,62.87 43.18,60.33 43.18,57.79 43.18,65.41 47.62,105.41 36.83,105.41 1.27,96.52 47.62,96.52 1.27,74.77 43.02,74.85 45.16,74.77 41.27,48.9 43.5,48.9 1.27,1.27 47.62,1.27 1.27,7.62 1.27,15.24 1.27,22.86 47.62,22.86 47.62,15.24 12.7,1.27 36.83,1.27 24.13,1.27 24.13,15.24 12.22,20.32 36.83,20.32 47.62,7.62 36.83,96.52 12.7,96.52 3.49,72.39 17.78,70.17 15.87,74.93 40.48,74.93 12.22,31.27 36.83,31.27 10.32,28.73 14.13,28.73 38.73,28.73 34.92,28.73 3.97,60.8 22.7,60.8 12.7,105.41 24.13,105.41 24.13,96.52 37.78,41.43 37.31,37.47 1.27,30.48 47.62,30.48 1.27,38.1 47.62,38.1 1.27,50.8 24.13,30.48 20.95,37.47 19.68,43.18 15.24,88.9 6.35,86.68 31.11,86.68 43.5,86.68 20.32,9.68
  pour Top: 48.9,106.68 48.9,0 0,0 0,106.68
  pour Bottom (isolate 0.203): 48.9,106.68 48.9,0 0,0 0,106.68
  pour InternalGround (isolate 0.203): 48.9,106.68 48.9,0 0,0 0,106.68
N$1
  Top 0.254: R85.2 R84.2 37.48,23.32 IC10.5
N$2
  Top 0.254: IC6.8 IC6.9
N$3  (via drill 0.3)
  Top 0.254: R48.2 | R48.2 35.56,57.47 36.35,56.67 36.35,51.59 38.42,49.53 38.42,47.62 v38.1,47.31 | v25.08,45.88 25.08,20.64 29.37,16.35 J6.P3
  Bottom 0.254: v25.08,45.88 26.51,47.31 v38.1,47.31
N$4
  Top 0.254: R82.2 R83.2 36.18,23.48 IC10.3
N$5
  Top 0.254: R89.2 R88.2 12.87,23.32 IC9.5
N$6
  Top 0.254: J2.P3 30.38,1.85 R97.1
N$7
  Top 0.254: J1.P3 42.65,1.85 R95.1
N$8
  Top 0.254: R86.2 R87.2 11.57,23.48 IC9.3
N$9
  Top 0.254: IC5.3 28.26,62.55 28.57,62.87 28.57,71.91 29.21,72.55 33.97,72.55 35.56,74.14 35.56,78.58 36.99,80.01 36.99,87.95 41.27,92.23 42.7,92.23 42.94,92.47 R106.P$2
N$10
  Top 0.254: R27.1 35.15,67.59 R29.2 C15.1 33.34,67.28 IC3.9
N$11
  Top 0.61: JP1.2 JP1.1 46.99,56.52 D2.A | D2.A
N$12
  Top 0.61: JP1.10 JP1.9 46.35,66.67 P1.2
N$13
  Top 0.61: P1.1 46.29,73.41 L1.2
N$14
  Top 0.254: R102.P$2 43.37,79.93 C4.1 43.46,82.16 R15.2
N$15
  Top 0.254: R4.2 45.44,94.7 R106.P$3
N$16
  Top 0.61: D2.C 46.92,49.78 L2.2
N$17
  Top 0.254: R44.1 | R44.1 C25.1
N$18
  Top 0.254: LED1.K 45.24,10.95 41.12,10.95 39.37,12.7 39.37,24.13 39.04,24.46 IC10.7
N$19
  Top 0.254: 44.41,13.97 R90.1 | 44.41,13.97 41.59,13.97 39.85,15.72 39.85,24.92 39.21,25.56 38.42,25.56 38.13,25.27 IC10.6 | LED1.A 44.41,12.73 44.41,13.97
N$20
  Top 0.254: R40.1 23.57,62.99 C21.1
N$21
  Top 0.254: J10.P2 30.6,38.77 R63.1
N$22
  Top 0.254: R25.1 24.54,69.89 R23.2 IC3.2
N$23
  Top 0.254: J3.P3 18.52,1.85 R94.1
N$24
  Top 0.254: IC5.10 R48.1 33.85,57.66 34.77,58.58 34.77,58.7 R44.2
N$25  (via drill 0.3)
  Top 0.254: v35.4,9.37 35.4,7.62 34.61,6.83 32.86,6.83 31.43,8.26 29.84,8.26 28.57,9.53 28.57,13.02 30,14.45 31.43,14.45 32.23,15.24 32.23,17.46 31.43,18.26 29.05,18.26 26.04,21.27 26.04,42.7 v26.35,43.02 | R25.2 | R25.2 22.38,70.01 21.91,69.53 21.91,58.1 22.54,57.47 22.54,55.56 22.23,55.24 22.23,53.5 21.91,53.18 21.91,48.58 23.97,46.51 24.29,46.2 v24.29,43.02 | v24.29,43.02
  Bottom 0.254: v26.35,43.02 v24.29,43.02 | J1.P2 42.23,9.37 v35.4,9.37
N$26  (via drill 0.3)
  Top 0.254: v20.8,56.52 20.48,56.83 20.48,70.48 24.92,74.93 24.92,77.63 24.61,77.95 24.61,80.8 23.5,81.92 23.5,83.19 24.61,84.3 24.61,88.27 28.57,92.23 30,92.23 30.64,92.87 R107.P$2 | IC5.6 26.13,59.37 24.92,59.37 v24.77,59.53 | v24.77,59.53
  Bottom 0.254: v24.77,59.53 24.77,58.58 22.7,56.52 v20.8,56.52
N$27
  Top 0.254: R60.2 C40.1 | C40.1 R58.1 | IC7.6 26.49,51.12 26.04,51.12 25.4,50.48 R54.1 25.36,50.04 25.72,49.69 25.72,49.41 C40.1
N$28
  Top 0.254: R33.2 | R33.2 IC5.1
N$29
  Top 0.254: IC4.3 9.53,62.55 9.84,62.87 9.84,72.07 13.02,75.25 13.02,78.42 12.22,79.22 12.22,88.27 16.19,92.23 17.78,92.23 18.26,92.71 R108.P$2
N$30
  Top 0.254: J9.P2 42.67,38.77 R61.1
N$31
  Top 0.254: R7.1 40.2,84.33 38.58,82.71 38.58,78.11 39.19,77.49 R98.2
N$32
  Top 0.254: R3.2 33.14,94.62 R107.P$3
N$33
  Top 0.254: R99.2 26.19,76.66 26.19,82.71 27.82,84.33 R8.1
N$34
  Top 0.254: R2.2 20.76,94.62 R108.P$3
N$35
  Top 0.254: LED2.K 34.92,13.49 34.45,13.97 34.45,24.11 | 34.45,24.11 | 34.45,24.11 34.45,24.29 34.62,24.46 IC10.1
N$36
  Top 0.254: R93.1 34.29,10.16 32.38,12.06 LED2.A 33.97,14.29 33.97,25.24 34.45,25.72 35.24,25.72 35.53,25.43 IC10.2
N$37
  Top 0.254: R55.1 34.45,50.13 R56.2 | R56.2 | R56.2 33.5,50.64 33.05,51.09 IC7.9
N$38  (via drill 0.3)
  Top 0.254: R55.2 35.68,47.82 36.83,46.67 36.83,43.81 v37.62,43.02 | v27.62,43.02 26.51,41.91 26.51,21.59 29.37,18.73 31.75,18.73 32.7,17.78 32.7,14.92 31.75,13.97 30.32,13.97 29.05,12.7 29.05,11.11 J2.P2 | v27.62,43.02
  Bottom 0.254: v27.62,43.02 v37.62,43.02
N$39  (via drill 0.3)
  Top 0.254: R54.2 v23.18,50.48 | v35.4,53.98 34.8,54.58 R52.1 | IC7.14 33.1,54.34 C31.2 R52.1 | R52.1
  Bottom 0.254: v35.4,53.98 31.59,53.98 28.1,50.48 v23.18,50.48
N$40  (via drill 0.3)
  Top 0.254: R8.2 | v29.84,86.68 R8.2
  Supplies 0.254: J10.P3 30.48,28.73 31.27,27.94 32.07,27.94 35.4,31.27 35.4,49.69 29.05,56.04 29.05,73.66 27.94,74.77 27.94,76.68 26.35,78.26 26.35,82.07 29.84,85.57 v29.84,86.68
N$41
  Top 0.254: C27.1 | R49.1 C27.1
N$42  (via drill 0.3)
  Top 0.254: IC5.5 | IC5.5 27.94,60.01 28.26,59.69 28.26,53.98 27.97,53.69 IC7.2 25.71,53.69 C33.1 25.28,53.5 | v20.95,55.4 20.95,55.56 21.59,56.2 21.59,56.83 20.95,57.47 20.95,70.17 25.56,74.77 28.26,74.77 29.39,75.9 R99.1 29.39,76.66 28.57,77.47 27.62,77.47 26.67,78.42 26.67,82.39 27.46,83.19 R14.1 29.88,82.16 R20.1 | 25.28,53.5 | 25.28,53.5 23.81,53.5 23.02,54.29 v23.02,54.93
  Bottom 0.254: v20.95,55.4 21.43,54.93 v23.02,54.93
N$43  (via drill 0.3)
  Top 0.254: v2.06,56.52 1.75,56.83 1.75,73.18 3.02,74.45 10.64,74.45 11.19,75.01 11.19,76.83 10.79,77.23 10.79,82.71 8.89,84.61 8.89,87.63 5.95,90.57 R109.P$2 | IC4.6 8.04,58.96 7.62,59.37 6.19,59.37 v6.03,59.53
  Bottom 0.254: v2.06,56.52 3.97,56.52 6.03,58.58 v6.03,59.53
N$44  (via drill 0.3)
  Top 0.254: R6.2 16.83,86.2 16.19,86.84 v16.19,87.15
  Supplies 0.254: v16.19,87.15 16.19,84.3 13.02,81.12 13.02,69.85 10.64,67.47 10.64,49.53 11.11,49.05 11.11,44.45 12.38,43.18 12.38,36.2 14.29,34.29 14.29,30.48 16.99,27.78 17.46,27.78 18.41,28.73 J11.P3 | J11.P3
N$45
  Top 0.254: R41.1 17.27,61.59 C22.1
N$46
  Top 0.254: IC4.15 R37.1 R41.2
N$47
  Top 0.254: R42.1 36,61.59 C23.1
N$48
  Top 0.254: J12.P2 6.47,38.77 R64.1
N$49
  Top 0.254: R26.1 16.92,67.59 R28.2 C14.1 14.45,67.28 IC2.9 | R26.1 17.06,67.59 17.09,67.63 | R30.1 16.99,66.71 R26.1
N$50
  Top 0.254: R81.1 38.78,31.12 IC10.8
N$51
  Top 0.254: R1.2 8.45,94.7 R109.P$3
N$52
  Top 0.254: R37.2 16.67,63.82 18.1,62.39 18.1,49.21 18.73,48.58 18.73,45.88 14.61,41.75 14.61,37.47 15.56,36.51 15.56,35.72 20.32,30.96 20.32,18.73 20.32,18.41 20.32,18.26 J7.P3
N$53
  Top 0.254: R52.2 | R52.2 C31.1 33.02,53.69 IC7.13 31.4,53.69 30.48,54.61 30.48,59.85 30.64,60.01 IC5.12 | IC5.12
N$54  (via drill 0.3)
  Top 0.254: R98.E 46.69,76.85 46.99,77.15 46.99,81.92 44.61,84.3 R13.1 | v37.78,77.79 37.94,77.63 37.94,74.93 36.83,73.82 36.83,66.67 37.78,65.72 37.78,52.55 39.85,50.48 39.85,45.56 v40.16,45.24 | v38.1,45.24 38.42,44.93 38.42,42.55 39.21,41.75 39.21,36.2 39.21,33.97 39.49,33.69 R73.2 39.49,32.89 D6.A
  Bottom 0.254: v37.78,77.79 46.35,77.79 46.69,77.45 R98.E | v38.1,45.24 v40.16,45.24
N$55  (via drill 0.3)
  Top 0.254: R9.2 | v5.24,86.68 R9.2
  Supplies 0.254: J12.P3 6.35,32.7 3.81,35.24 3.81,41.91 1.27,44.45 1.27,48.9 2.54,50.16 2.54,52.07 1.27,53.34 1.27,72.71 3.33,74.77 3.33,76.68 2.06,77.95 2.06,82.39 5.24,85.57 v5.24,86.68
N$56  (via drill 0.3)
  Top 0.254: R31.2 | C16.1 6.7,67.31 6.73,67.28 IC2.6 | R31.2 5.52,67.31 v4.45,67.31 | v15.08,61.28 | v15.08,61.28 IC4.13 | C16.1 | R31.2 C16.1
  Bottom 0.254: v4.45,67.31 3.17,66.04 3.17,63.02 4.92,61.28 v15.08,61.28
N$57
  Top 0.254: 38.1,30.18 IC10.9 38.13,32.23 | R68.2 38.29,34.04 R73.1 38.26,33.14 38.26,32.86 38.13,32.73 38.13,32.23 | R77.2 37.34,32.23 38.13,32.23
N$58
  Top 0.254: LED3.K 21.75,13.81 16.83,13.81 14.76,15.88 14.76,23.95 14.76,24.13 14.43,24.46 IC9.7 | LED3.K
N$59
  Top 0.254: IC9.6 13.52,25.27 13.81,25.56 14.45,25.56 15.24,24.77 15.24,16.19 17.14,14.29 22.7,14.29 23.97,13.02 23.97,12.22 23.18,11.43 22.23,11.43 | LED3.A 20.32,12.06 20.95,11.43 22.23,11.43 | R92.1 22.23,11.43
N$60
  Top 0.254: R24.1 5.8,69.89 R22.2 IC2.2
N$61  (via drill 0.3)
  Top 0.254: v11.27,9.37 11.27,7.62 10.48,6.83 8.73,6.83 7.3,8.26 5.71,8.26 4.92,9.05 4.92,12.7 6.67,14.45 7.46,14.45 8.1,15.08 8.1,17.62 7.46,18.26 6.19,18.26 4.29,20.16 4.29,44.61 3.49,45.4 3.49,55.24 3.81,55.56 3.81,57.47 3.17,58.1 3.17,69.53 3.65,70.01 R24.2
  Bottom 0.254: J3.P2 18.1,9.37 v11.27,9.37
N$62
  Top 0.254: IC4.12 11.91,60.01 11.75,59.85 11.75,54.77 11.75,54.61 12.67,53.69 IC6.13 14.29,53.69 C32.1 R51.2
N$63
  Top 0.254: R39.1 4.83,62.99 C20.1
N$64
  Top 0.254: R100.2 13.81,76.66 13.81,82.71 15.75,84.65 R6.1
N$65  (via drill 0.3)
  Top 0.254: 29.05,71.6 29.53,72.07 33.34,72.07 | 33.34,72.07 34.29,72.07 36.99,74.77 v36.99,76.52 | IC3.13 32.24,69.85 32.7,69.85 33.3,70.45 C9.1 33.34,71.39 33.34,72.07 | R98.1 41.69,76.89 40.48,78.11 39.37,78.11 39.05,78.42 39.05,82.39 39.85,83.19 R15.1 42.26,82.16 R21.1 | 29.05,71.6 | 29.05,71.6 29.05,62.23 28.1,61.28 IC5.4 | 26.83,61.28
  Top 0.406: IC5.4 26.83,61.28
  Bottom 0.254: v36.99,76.52 38.26,76.52 38.89,77.15 40.64,77.15 41.69,76.1 R98.1
N$66
  Top 0.254: R38.2 35.56,63.82 36.83,62.55 36.83,51.91 38.89,49.85 38.89,44.61 40.16,43.34 40.16,35.08 44.45,30.8 44.45,19.05 42.55,17.14 J5.P3
N$67
  Top 0.254: 10.32,71.75 10.79,72.23 14.13,72.23 14.57,71.79 C8.1 | IC2.13 14,69.88 14.57,70.45 C8.1 | C8.1 15.4,71.44 17.01,73.05 R100.1 15.5,77.47 14.76,77.47 14.29,77.95 14.29,82.39 15.08,83.19 R16.1 17.5,82.16 R19.1 | IC4.4 | 10.32,71.75 | 10.32,71.75 10.32,62.23 9.37,61.28 IC4.4
N$68  (via drill 0.3)
  Top 0.254: v29.84,71.28 29.53,70.96 29.53,50.48 32.86,47.15 34.77,47.15 35.4,46.51 | R99.E 34.39,76.62 34.61,76.83 34.61,81.92 32.23,84.3 R12.1 | 35.4,46.51 35.88,46.04 35.88,38.1 35.88,37.62 34.01,35.75 R72.2 34.01,33.05 D5.A | 35.4,46.51
  Supplies 0.254: v29.84,71.28 | 34.37,75.98 R99.E 34.39,75.03 33.02,73.66 30.96,73.66 29.84,72.55 v29.84,71.28 | v29.84,71.28
N$69  (via drill 0.3)
  Top 0.254: R47.2 16.83,57.47 17.62,56.67 17.62,49.69 | 17.62,49.69 | 17.62,49.69 14.29,46.35 v14.29,44.29 | v14.29,44.29 | v2.7,44.29 2.7,42.86 3.33,42.23 3.33,20.16 3.33,19.53 3.33,19.37 J8.P3
  Bottom 0.254: v2.7,44.29 v14.29,44.29
N$70
  Top 0.254: R101.2 1.59,76.58 1.59,82.71 3.21,84.33 R9.1
N$71
  Top 0.254: J4.P3 6.25,1.85 R96.1
N$72
  Top 0.254: R43.1 | R43.1 C24.1
N$73
  Top 0.254: IC4.10 R47.1 15.12,57.66 16.03,58.58 16.03,58.7 R43.2
N$74
  Top 0.254: R79.1 34.88,31.12 IC10.14
N$75
  Top 0.254: IC5.15 R38.1 R42.2 | R42.2
N$76
  Top 0.254: R57.1 | R57.1 C41.1 | R59.2 | C41.1 R59.2 | 7.76,51.12 IC6.6 7.24,51.09 R53.1 6.63,50.04 6.99,49.69 6.99,49.41 C41.1
N$77  (via drill 0.3)
  Top 0.254: 30,62.55 30,69.69 v30.64,70.33 30.84,70.53 IC3.14 32.19,71.27 C9.2 | 30,62.55 30,50.8 33.18,47.62 35.08,47.62 36.35,46.35 36.35,36.51 37.5,35.37 R68.1 | IC5.14 30,62.55 | v35.56,80.49 36.51,81.44 36.51,88.27 40.44,92.19 R106.P$1
  Supplies 0.254: v30.64,70.33 30.64,72.07 31.51,72.95 33.18,72.95 35.56,75.33 v35.56,80.49
N$78
  Top 0.254: IC10.13 35.53,32.23 | 35.53,32.23 35.53,32.86 R72.1 35.21,34.04 R67.2 | R76.2 36.16,32.23 35.53,32.23
N$79
  Top 0.254: R78.1 14.17,31.12 IC9.8
N$80  (via drill 0.3)
  Top 0.254: IC5.11 v33.81,58.74 | v24.29,54.29 25.12,54.29 C33.2 25.64,54.34 IC7.1 | v20.8,53.98 20.95,53.82 20.95,49.53 20.16,48.74 20.16,48.1 20.64,47.62 22.07,47.62 23.65,46.04 23.81,45.88 23.81,44.45 v23.34,43.97 | v20.8,53.98 20,54.77 20,70.8 24.45,75.25 24.45,77.31 24.13,77.63 | v20.8,53.98 | R107.P$1 28.14,92.59 24.13,88.58 24.13,84.61 23.02,83.5 23.02,81.6 24.13,80.49 24.13,77.63 | v28.42,42.23 29.05,42.86 33.66,42.86 34.92,41.59 34.92,38.26 34.13,37.47 v33.66,37.47 | 24.13,77.63 | v36.2,35.4 36.16,35.37 R67.1
  Bottom 0.254: v20.8,53.98 23.97,53.98 v24.29,54.29 27.94,54.29 32.38,58.74 v33.81,58.74 | v23.34,43.97 23.34,42.55 23.65,42.23 v28.42,42.23 | v33.66,37.47 35.72,35.4 v36.2,35.4
N$81
  Top 0.254: IC4.1 | R34.2 IC4.1
N$82  (via drill 0.3)
  Top 0.254: v16.35,47.15 15.88,47.15 15.08,46.35 15.08,43.81 13.65,42.39 13.65,36.83 14.61,35.88 14.61,35.08 14.92,34.77 14.92,33.21 R70.2 14.89,32.89 D4.A | v20,47.15 19.68,47.47 19.68,49.05 20.48,49.85 20.48,53.18 19.53,54.13 19.53,71.12 22.01,73.6 R100.E 22.01,76.62 22.23,76.83 22.23,80.49 21.75,80.96 21.75,83.03 20.32,84.45 R10.1
  Bottom 0.254: v16.35,47.15 v20,47.15
N$83
  Top 0.254: IC9.9 13.52,32.23 | 13.52,32.23 13.52,33.02 R70.1 13.69,34.04 R65.2 | R75.2 12.73,32.23 13.52,32.23
N$84
  Top 0.254: LED4.K 10.79,12.86 9.84,13.81 9.84,24.29 10.01,24.46 IC9.1
N$85
  Top 0.254: R91.1 10.16,10.16 8.26,12.06 LED4.A 9.37,13.81 9.37,25.08 9.84,25.56 10.64,25.56 10.92,25.27 IC9.2
N$86
  Top 0.254: R80.1 10.27,31.12 IC9.14
N$87  (via drill 0.3)
  Top 0.254: 13.34,62.45 IC4.14 11.27,62.55 | 11.27,62.55 11.27,69.85 v11.75,70.33 11.95,70.53 IC2.14 13.37,70.62 C8.2 | v11.91,78.42 11.75,78.58 11.75,88.58 15.76,92.59 R108.P$1 | 11.27,62.55 11.27,37.15 13.05,35.37 R65.1
  Supplies 0.254: 11.91,74.93 11.91,70.48 v11.75,70.33 | 11.91,74.93 | 11.91,74.93 v11.91,78.42
N$88  (via drill 0.3)
  Top 0.254: v16.67,53.98 16.07,54.58 R51.1 C32.2 14.37,54.34 IC6.14 | R53.2 | v4.45,50.48 R53.2
  Bottom 0.254: v16.67,53.98 12.86,53.98 9.37,50.48 v4.45,50.48
N$89
  Top 0.254: J11.P2 18.54,38.77 R62.1
N$90
  Top 0.254: R50.1 C28.1
N$91  (via drill 0.3)
  Top 0.254: IC4.5 9.21,60.01 9.53,59.69 9.53,54.13 9.08,53.69 IC6.2 6.98,53.69 C30.1 6.54,53.5 6.38,53.34 5.08,53.34 4.29,54.13 v4.29,54.93 | v4.29,73.5 2.86,73.5 2.22,72.87 2.22,57.47 2.86,56.83 2.86,56.2 2.22,55.56 v2.22,55.4 | R101.1 3.19,77.47 2.54,77.47 2.06,77.95 2.06,82.39 2.86,83.19 R17.1 5.27,82.16 R18.1
  Bottom 0.254: v4.29,54.93 2.7,54.93 v2.22,55.4 | v4.29,73.5 4.7,73.92 R101.1
N$92  (via drill 0.3)
  Top 0.254: R101.E 9.7,76.5 9.84,76.64 9.84,82.04 R11.1 | v11.11,71.44 10.79,71.12 10.79,66.2 10.79,48.9 10.79,38.26 10.79,37.94 9.4,36.55 R71.2 10.22,32.35 D3.A
  Supplies 0.254: R101.E 11.11,74.55 v11.11,71.44
N$93
  Top 0.254: IC9.13 10.92,32.23 | 10.92,32.23 10.92,32.73 10.64,33.02 10.64,33.14 R71.1 10.6,34.04 R66.2 | R74.2 11.55,32.23 10.92,32.23
N$95  (via drill 0.3)
  Top 0.254: v5.4,54.29 6.38,54.29 C30.2 6.91,54.34 IC6.1 | v15.08,58.74 IC4.11 | R109.P$1 3.45,92.59 3.81,92.23 4.76,92.23 5.4,91.6 5.4,90.33 8.41,87.31 8.41,84.3 10.32,82.39 10.32,76.99 10.72,76.6 10.72,75.33 10.32,74.93 2.7,74.93 2.54,74.77 1.27,73.5 1.27,54.77 v2.06,53.98 2.54,53.5 2.54,49.69 1.75,48.9 1.75,45.09 1.91,44.93 1.91,42.86 2.86,41.91 2.86,33.97 v2.54,33.66 | v11.59,34.45 11.59,34.92 11.15,35.37 R66.1
  Bottom 0.254: v2.06,53.98 5.08,53.98 v5.4,54.29 8.89,54.29 13.34,58.74 v15.08,58.74 | v11.59,34.45 8.89,34.45 8.1,33.66 v2.54,33.66
N$96  (via drill 0.3)
  Top 0.254: IC3.6 C17.1 R32.2 | R32.2 24.25,67.31 v23.18,67.31 | v33.81,61.28 IC5.13 | R32.2
  Bottom 0.254: v23.18,67.31 21.91,66.04 21.91,63.5 24.13,61.28 v33.81,61.28
N$100  (via drill 0.3)
  Top 0.254: v23.18,66.2 23.3,66.08 R32.1 | R32.1 | R32.1 C17.2 25.95,66.63 IC3.7 | R27.2 | v36.04,69.06 R27.2
  Bottom 0.254: v36.04,69.06 33.18,66.2 v23.18,66.2
N$101
  Top 0.254: R105.P$2 30.99,79.85 C3.1 31.08,82.16 R14.2
N$102
  Top 0.254: R103.P$2 18.61,79.85 C5.1 18.7,82.16 R16.2
N$103  (via drill 0.3)
  Top 0.254: R26.2 17.02,68.9 v18.1,68.9 | R31.1 | R31.1 C16.2 7.22,66.63 IC2.7 | R31.1 5.43,66.2 v4.45,66.2
  Bottom 0.254: v18.1,68.9 15.4,66.2 v4.45,66.2
N$104
  Top 0.254: R104.P$2 6.38,79.93 C2.1 6.47,82.16 R17.2
OUT1  (via drill 0.3)
  Top 0.254: R85.1 38.58,21.59 38.89,21.27 38.89,17.78 | v44.45,17.78 44.93,18.26 44.93,36.04 43.5,37.47 41.59,37.47 40.64,38.42 40.64,43.66 39.37,44.93 39.37,50.16 37.31,52.23 37.31,65.41 36.83,65.88 35.4,65.88 34.89,66.39 R29.1 C15.2 33.42,66.63 IC3.8 | v44.45,17.78 | 38.89,17.78 v38.26,17.78 | 38.89,17.78 | 38.89,17.78 38.89,10.48 40.64,8.73 40.64,5.08 41.43,4.29 45.72,4.29 46.35,3.65 R95.2
  Bottom 0.254: v38.26,17.78 v44.45,17.78
OUT2
  Top 0.254: R82.1 35.24,13.97 36.2,13.02 36.2,7.46 33.18,4.45 28.73,4.45 28.1,5.08 | IC7.7 26.51,50.42 26.51,50.16 26.95,49.72 C40.2 R60.1 26.95,46.39 25.56,45 25.56,20.95 28.73,17.78 31.11,17.78 31.75,17.14 31.75,15.56 31.11,14.92 29.53,14.92 28.1,13.49 28.1,5.08 | R97.2 28.1,4.98 28.1,5.08
OUT3
  Top 0.254: R89.1 | R89.1 13.97,21.27 14.29,20.95 14.29,15.56 16.51,13.34 16.51,9.53 17.78,8.26 20,8.26 21.43,6.83 24.45,6.83 | 22.63,3.55 R94.2 22.6,3.55 24.45,5.4 24.45,6.83 | IC2.8 14.53,66.63 C14.2 R28.1 16,66.39 16.51,65.88 18.26,65.88 18.57,65.56 18.57,49.53 19.21,48.9 19.21,45.56 15.08,41.43 15.08,39.21 16.83,37.47 19.53,37.47 20.8,36.2 20.8,16.99 24.45,13.34 24.45,6.83
OUT4  (via drill 0.3)
  Top 0.254: 10.64,14.29 R86.1 | 10.64,14.29 12.06,12.86 12.06,7.46 9.05,4.45 5.08,4.45 4.45,5.08 | 10.64,14.29 | R59.1 | R59.1 C41.2 8.22,49.56 7.78,50.01 7.78,50.42 IC6.7 | 4.45,5.08 4.45,13.02 6.35,14.92 6.99,14.92 7.62,15.56 7.62,17.14 6.99,17.78 5.87,17.78 3.81,19.84 3.81,42.55 3.49,42.86 v3.49,43.5 | 4.45,5.08 2.91,3.55 R96.2 | R59.1 8.26,48.23 v8.26,43.5
  Bottom 0.254: v3.49,43.5 v8.26,43.5
PROT1  (via drill 0.3)
  Top 0.254: v39.37,42.86 39.69,42.55 39.69,34.29 40.16,33.81 40.16,33.02 40.16,32.7 40.13,32.67 D6.C R81.2 | R81.2
  Bottom 0.254: v39.37,42.86 40.01,43.5 44.61,43.5 46.69,45.58 R98.B
PROT2
  Top 0.254: 34.39,45.94 R99.B 34.39,45.94 35.4,44.93 35.4,37.94 33.5,36.04 33.34,35.88 33.34,33.02 33.34,32.54 33.53,32.35 D5.C R79.2 | R79.2
PROT3  (via drill 0.3)
  Top 0.254: v15.88,44.77 15.88,43.81 14.13,42.07 14.13,37.15 15.08,36.2 15.08,35.4 15.56,34.92 15.56,32.7 15.52,32.67 D4.C R78.2
  Bottom 0.254: v15.88,44.77 21.11,44.77 22.01,45.66 R100.B
PROT4
  Top 0.254: R101.B 10.32,45.34 10.32,42.7 10.32,38.26 8.73,36.67 8.73,32.54 8.93,32.35 D3.C R80.2
VCC  (via drill 0.3, 0.6)
  Top 0.254: C11.1 | C43.1 11.17,27.09 12.22,26.04 IC9.4 | C45.1 35.93,27.09 36.83,26.19 IC10.4 | v25.4,68.9 25.56,68.74 25.88,68.74 26.04,68.58 IC3.4
  Top 0.305: C10.1 v6.67,68.9 6.83,68.9 7.14,68.58 IC2.4 | v3.97,65.09 R34.1 | IC6.4 6.83,52.39 6.54,52.67 C37.1 5.52,52.7 5.36,52.55 v4.45,52.55 | v25.4,68.9 C11.1 | R33.1 | v22.7,65.09 R33.1 | C19.1 v33.97,65.09 IC5.16 | C34.1 24.25,52.7 | C34.1 24.32,52.7 24.48,52.55 25.72,52.55 25.88,52.39 IC7.4 | v23.18,52.55 23.3,52.67 C34.1 | IC4.16 | IC4.16 v15.24,65.09 C18.1 | C18.1 | v24.13,32.38 R69.1
  Top 0.61: L2.1 45.4,52.7 44.77,53.34 43.63,53.34 C36.1 C35.1 39.4,53.47 v39.37,53.5 | C50.1 8.89,26.16 C43.1 8.63,27.09 v6.99,28.73 | C48.1 33.5,26.16 C45.1 33.44,27.15 33.28,26.99 32.7,26.99 31.59,28.1 v31.59,29.05
  Supplies 0.305: 7.62,65.09 v3.97,65.09 | 7.62,52.55 v4.45,52.55 | 7.62,68.9 v6.67,68.9 | 26.51,68.9 v25.4,68.9 | 26.51,65.09 v22.7,65.09 | 39.37,65.09 v33.97,65.09 | 26.51,52.55 v23.18,52.55
  Supplies 0.406: v24.13,32.38 24.77,33.02 32.7,33.02
  Supplies 0.61: v35.88,71.91 39.37,68.42 39.37,65.09 v39.37,53.5 | v7.62,73.5 7.62,68.9 7.62,65.09 7.62,52.55 7.62,51.44 8.41,50.64 8.41,45.24 11.43,42.23 11.43,36.83 10.48,35.88 10.48,32.23 v6.99,28.73 | v26.51,73.5 26.51,68.9 26.51,65.09 26.51,52.55 26.51,51.28 32.7,45.09 32.7,33.02 32.7,30.16 v31.59,29.05
  Bottom 0.305: v15.24,65.09 17.46,67.31 19.05,67.31 20.64,68.9 v25.4,68.9
  Bottom 0.61: v35.88,71.91 34.29,73.5 v26.51,73.5 v7.62,73.5
VEE  (via drill 0.3, 0.6)
  Top 0.254: v16.19,52.39 15.12,52.39 C38.2 15.05,52.39 IC6.11 | v15.24,70.01 | C12.2 | C12.2 IC2.11 | v15.24,70.01 14.8,69.57 C12.2 | C13.2 | C13.2 IC3.11 | v35.56,52.39 34.48,52.39 C39.2 34.41,52.39 IC7.11 | C13.2 33.81,68.61 33.81,69.53 v34.13,69.85 | v34.13,69.85 | C44.2 13.71,27.09 12.22,28.57 IC9.11 | IC10.11 36.83,28.42 38.16,27.09 C46.2
  Top 0.406: v13.18,55.24 13.34,55.4 14.76,55.4 15.08,55.72 15.08,56.16 C26.2 IC4.9 | v31.91,55.24 32.07,55.4 33.34,55.4 33.81,55.88 33.81,56.16 C29.2 IC5.9 | v23.5,75.56 23.5,80.17 22.38,81.28 22.38,83.34 20.24,85.49 R5.1
  Top 0.61: L1.1 44.45,71.12 43.81,70.48 42.67,70.48 C7.2 C6.2 40.32,69.85 39.37,68.9 38.42,68.9 D1.A v38.1,67.63 | 17.3,28.42 16.03,27.15 15.61,27.15 C44.2 15.56,26.32 C47.2 | C49.2 40.16,26.32 C46.2 | C46.2 40.16,27.15 | v42.23,28.73 40.58,27.09 C46.2 | v38.1,67.63 | 17.3,28.42 | 17.3,28.42 v17.3,29.05
  Supplies 0.254: 13.18,52.39 v16.19,52.39
  Supplies 0.61: v35.56,52.39 34.77,52.39 v31.91,55.24 31.91,65.56 33.97,67.63 | v15.24,70.01 13.18,67.94 v13.18,55.24 13.18,52.39 13.18,51.12 13.18,36.83 15.24,34.77 15.24,31.11 v17.3,29.05 | v15.24,70.01 | v35.56,52.39 | v35.56,52.39 35.88,52.39 36.67,51.59 36.67,40.8 38.42,39.05 38.42,32.54 v42.23,28.73 | v35.56,52.39 | v38.1,67.63 33.97,67.63 | 33.97,67.63 34.13,67.79 v34.13,69.85 | v23.5,75.56 22.54,74.61 17.78,74.61 15.24,72.07 v15.24,70.01
  Bottom 0.61: v38.1,67.63 38.1,72.55 36.04,74.61 26.19,74.61 25.24,75.56 v23.5,75.56

### Text on the board
tPlace: Red stripe
tNames: Veils | cc-by-sa | Émilie Gillet | 2019 v11